# EAGLE design Flotelli (EAGLE 6.5.0)

## Sheet 1 of 5: CPU
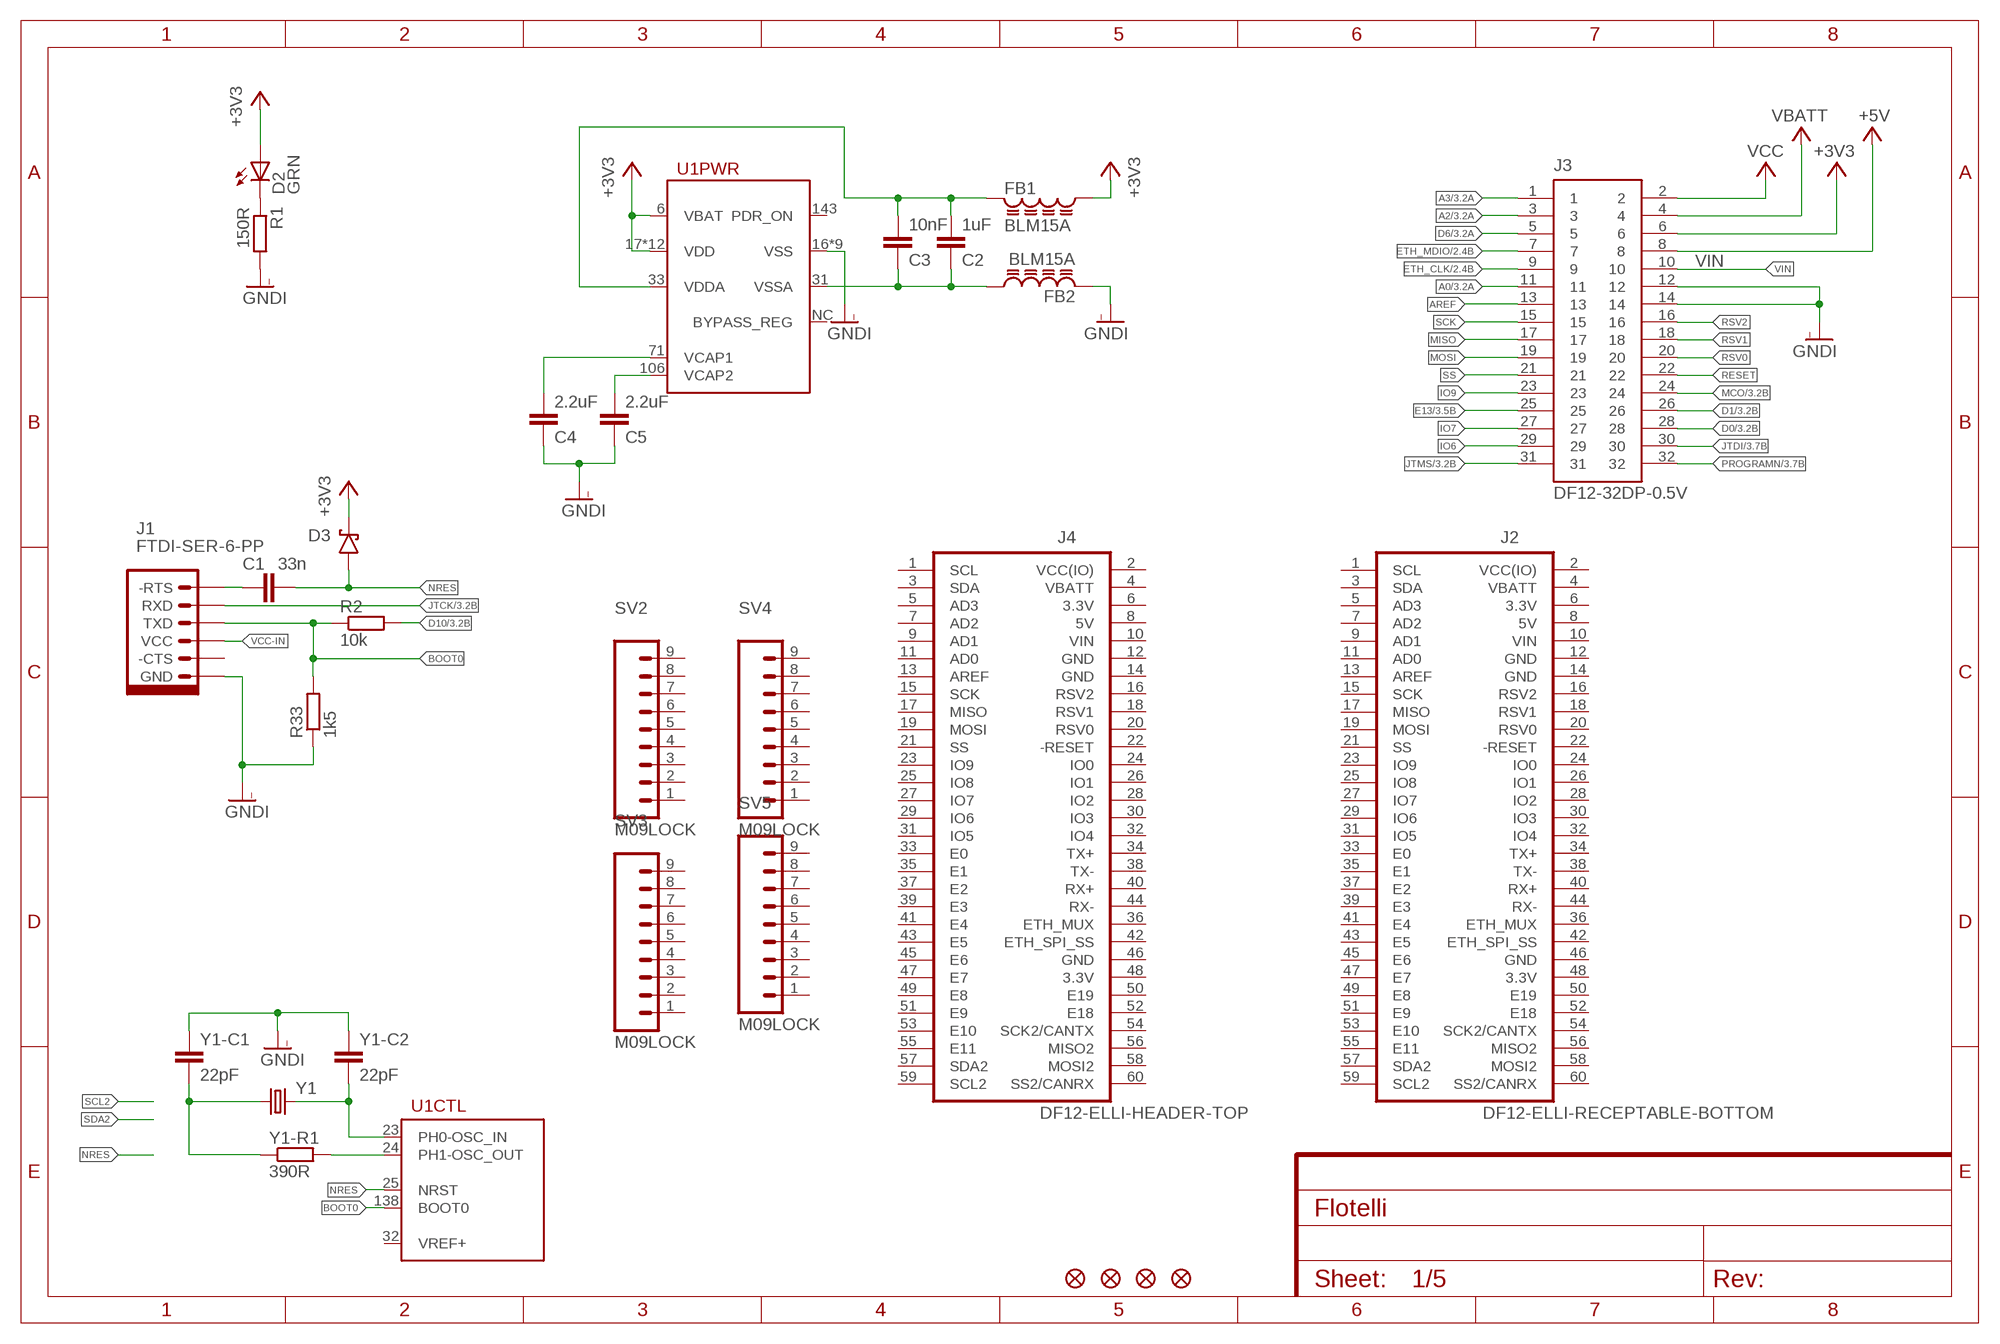
[diagram p0: schematic, sheet 1]

### Parts
C1  33n  C0402  [C0402]
C2  1uF  C0402  [C0402]
C3  10nF  C0402  [C0402]
C4  2.2uF  C0402  [C0402]
C5  2.2uF  C0402  [C0402]
D2  GRN  LED-GREEN0603  [LED-0603]
D3  BAT60J  [SOD323_DIODE]
FB1  BLM15A  LQM15  [0402]
FB2  BLM15A  LQM15  [0402]
FID1  FIDUCIAL""  [FIDUCIAL_1MM]
FID2  FIDUCIAL""  [FIDUCIAL_1MM]
FID3  FIDUCIAL""  [FIDUCIAL_1MM]
FID4  FIDUCIAL""  [FIDUCIAL_1MM]
J1  FTDI-SER-6-PP  [FTDI-SER-6-SIL]
J2  DF12-ELLI-RECEPTABLE-BOTTOM  [DF12-60DS-0.5V]
J3  DF12-32DP-0.5V  [DF12(4.0)-32DP-0.5V]
J4  DF12-ELLI-HEADER-TOP  [DF12(4.0)-60DP-0.5V]
R1  150R  R0402  [R0402]
R2  10k  R0402  [R0402]
R33  1k5  R0402  [R0402]
SV2  M09LOCK  [1X09_LOCK]
SV3  M09LOCK  [1X09_LOCK]
SV4  M09LOCK  [1X09_LOCK]
SV5  M09LOCK  [1X09_LOCK]
U1  STM32F429ZIT  [LQFP144]
Y1  CRYSTALSM49  [SM49]
Y1-C1  22pF  C0402  [C0402]
Y1-C2  22pF  C0402  [C0402]
Y1-R1  390R  R0402  [R0402]

### Nets
+3V3 [power]: D2.A D3.1(C) FB1.2 J3.6 U1.6(PWR:VBAT) U1.17(PWR:VDD) U1.30(PWR:VDD) U1.39(PWR:VDD) U1.52(PWR:VDD) U1.62(PWR:VDD) U1.72(PWR:VDD) U1.84(PWR:VDD) U1.95(PWR:VDD) U1.108(PWR:VDD) U1.121(PWR:VDD) U1.131(PWR:VDD) U1.144(PWR:VDD) ; also sheet 2
+5V [power]: J3.8
A0: J3.11 ; also sheet 3
A2: J3.3 ; also sheet 3
A3: J3.1 ; also sheet 3
AREF: J3.13
BOOT0: J1.TXD R2.1 R33.2 U1.138(CTL:BOOT0)
D0: J3.28 ; also sheet 3
D1: J3.26 ; also sheet 3
D6: J3.5 ; also sheet 3
D10: R2.2 ; also sheet 3
E13: J3.25 ; also sheet 3
ETH_CLK: J3.9 ; also sheet 2,3
ETH_MDIO: J3.7 ; also sheet 2,3
GNDI [power]: C4.1 C5.1 FB2.1 J1.GND J3.12 J3.14 R1.2 R33.1 U1.16(PWR:VSS) U1.38(PWR:VSS) U1.51(PWR:VSS) U1.61(PWR:VSS) U1.83(PWR:VSS) U1.94(PWR:VSS) U1.107(PWR:VSS) U1.120(PWR:VSS) U1.130(PWR:VSS) Y1-C1.1 Y1-C2.1 ; also sheet 2
IO6: J3.29
IO7: J3.27
IO9: J3.23
JTCK: J1.RXD ; also sheet 3
JTDI: J3.30 ; also sheet 3
JTMS: J3.31 ; also sheet 3
MCO: J3.24 ; also sheet 3
MISO: J3.17
MOSI: J3.19
N41567: D2.C R1.1
N98218 [power]: C2.1 C3.1 FB2.2 U1.31(PWR:VSSA)
N100630 [power]: C2.2 C3.2 FB1.1 U1.33(PWR:VDDA)
N205481: Y1-C1.2 Y1-R1.1 Y1.1
N$4: C4.2 U1.71(PWR:VCAP1)
N$5: C5.2 U1.106(PWR:VCAP2)
NDSR2: C1.1 J1.-RTS
NRES: C1.2 D3.2(A) U1.25(CTL:NRST)
PF0: U1.23(CTL:PH0-OSC_IN) Y1-C2.2 Y1.2
PF1: U1.24(CTL:PH1-OSC_OUT) Y1-R1.2
PROGRAMN: J3.32 ; also sheet 3
RESET: J3.22
RSV0: J3.20
RSV1: J3.18
RSV2: J3.16
SCK: J3.15
SS: J3.21
VBATT: J3.4
VCC: J3.2
VCC-IN: J1.VCC
VIN: J3.10
Unconnected: J1.-CTS J2.1(SCL) J2.3(SDA) J2.5(AD3) J2.7(AD2) J2.9(AD1) J2.11(AD0) J2.13(AREF) J2.15(SCK) J2.16(RSV2) J2.17(MISO) J2.18(RSV1) J2.19(MOSI) J2.20(RSV0) J2.21(SS) J2.22(-RESET) J2.23(IO9) J2.24(IO0) J2.25(IO8) J2.26(IO1) J2.27(IO7) J2.28(IO2) J2.29(IO6) J2.30(IO3) J2.31(IO5) J2.32(IO4) J2.33(E0) J2.34(TX+) J2.35(E1) J2.36(ETH_MUX) J2.37(E2) J2.38(TX-) J2.39(E3) J2.40(RX+) J2.41(E4) J2.42(ETH_SPI_SS) J2.43(E5) J2.44(RX-) J2.45(E6) J2.46(GND) J2.47(E7) J2.48(3.3V) J2.49(E8) J2.50(E19) J2.51(E9) J2.52(E18) J2.53(E10) J2.54(SCK2/CANTX) J2.55(E11) J2.56(MISO2) J2.57(SDA2) J2.58(MOSI2) J2.59(SCL2) J2.60(SS2/CANRX) J4.1(SCL) J4.3(SDA) J4.5(AD3) J4.7(AD2) J4.9(AD1) J4.11(AD0) J4.13(AREF) J4.15(SCK) J4.16(RSV2) J4.17(MISO) J4.18(RSV1) J4.19(MOSI) J4.20(RSV0) J4.21(SS) J4.22(-RESET) J4.23(IO9) J4.24(IO0) J4.25(IO8) J4.26(IO1) J4.27(IO7) J4.28(IO2) J4.29(IO6) J4.30(IO3) J4.31(IO5) J4.32(IO4) J4.33(E0) J4.34(TX+) J4.35(E1) J4.36(ETH_MUX) J4.37(E2) J4.38(TX-) J4.39(E3) J4.40(RX+) J4.41(E4) J4.42(ETH_SPI_SS) J4.43(E5) J4.44(RX-) J4.45(E6) J4.46(GND) J4.47(E7) J4.48(3.3V) J4.49(E8) J4.50(E19) J4.51(E9) J4.52(E18) J4.53(E10) J4.54(SCK2/CANTX) J4.55(E11) J4.56(MISO2) J4.57(SDA2) J4.58(MOSI2) J4.59(SCL2) J4.60(SS2/CANRX) SV2.1 SV2.2 SV2.3 SV2.4 SV2.5 SV2.6 SV2.7 SV2.8 SV2.9 SV3.1 SV3.2 SV3.3 SV3.4 SV3.5 SV3.6 SV3.7 SV3.8 SV3.9 SV4.1 SV4.2 SV4.3 SV4.4 SV4.5 SV4.6 SV4.7 SV4.8 SV4.9 SV5.1 SV5.2 SV5.3 SV5.4 SV5.5 SV5.6 SV5.7 SV5.8 SV5.9 U1.32(CTL:VREF+) U1.143(PWR:PDR_ON) U1.NC(PWR:BYPASS_REG)

## Sheet 2 of 5: Eth & USB
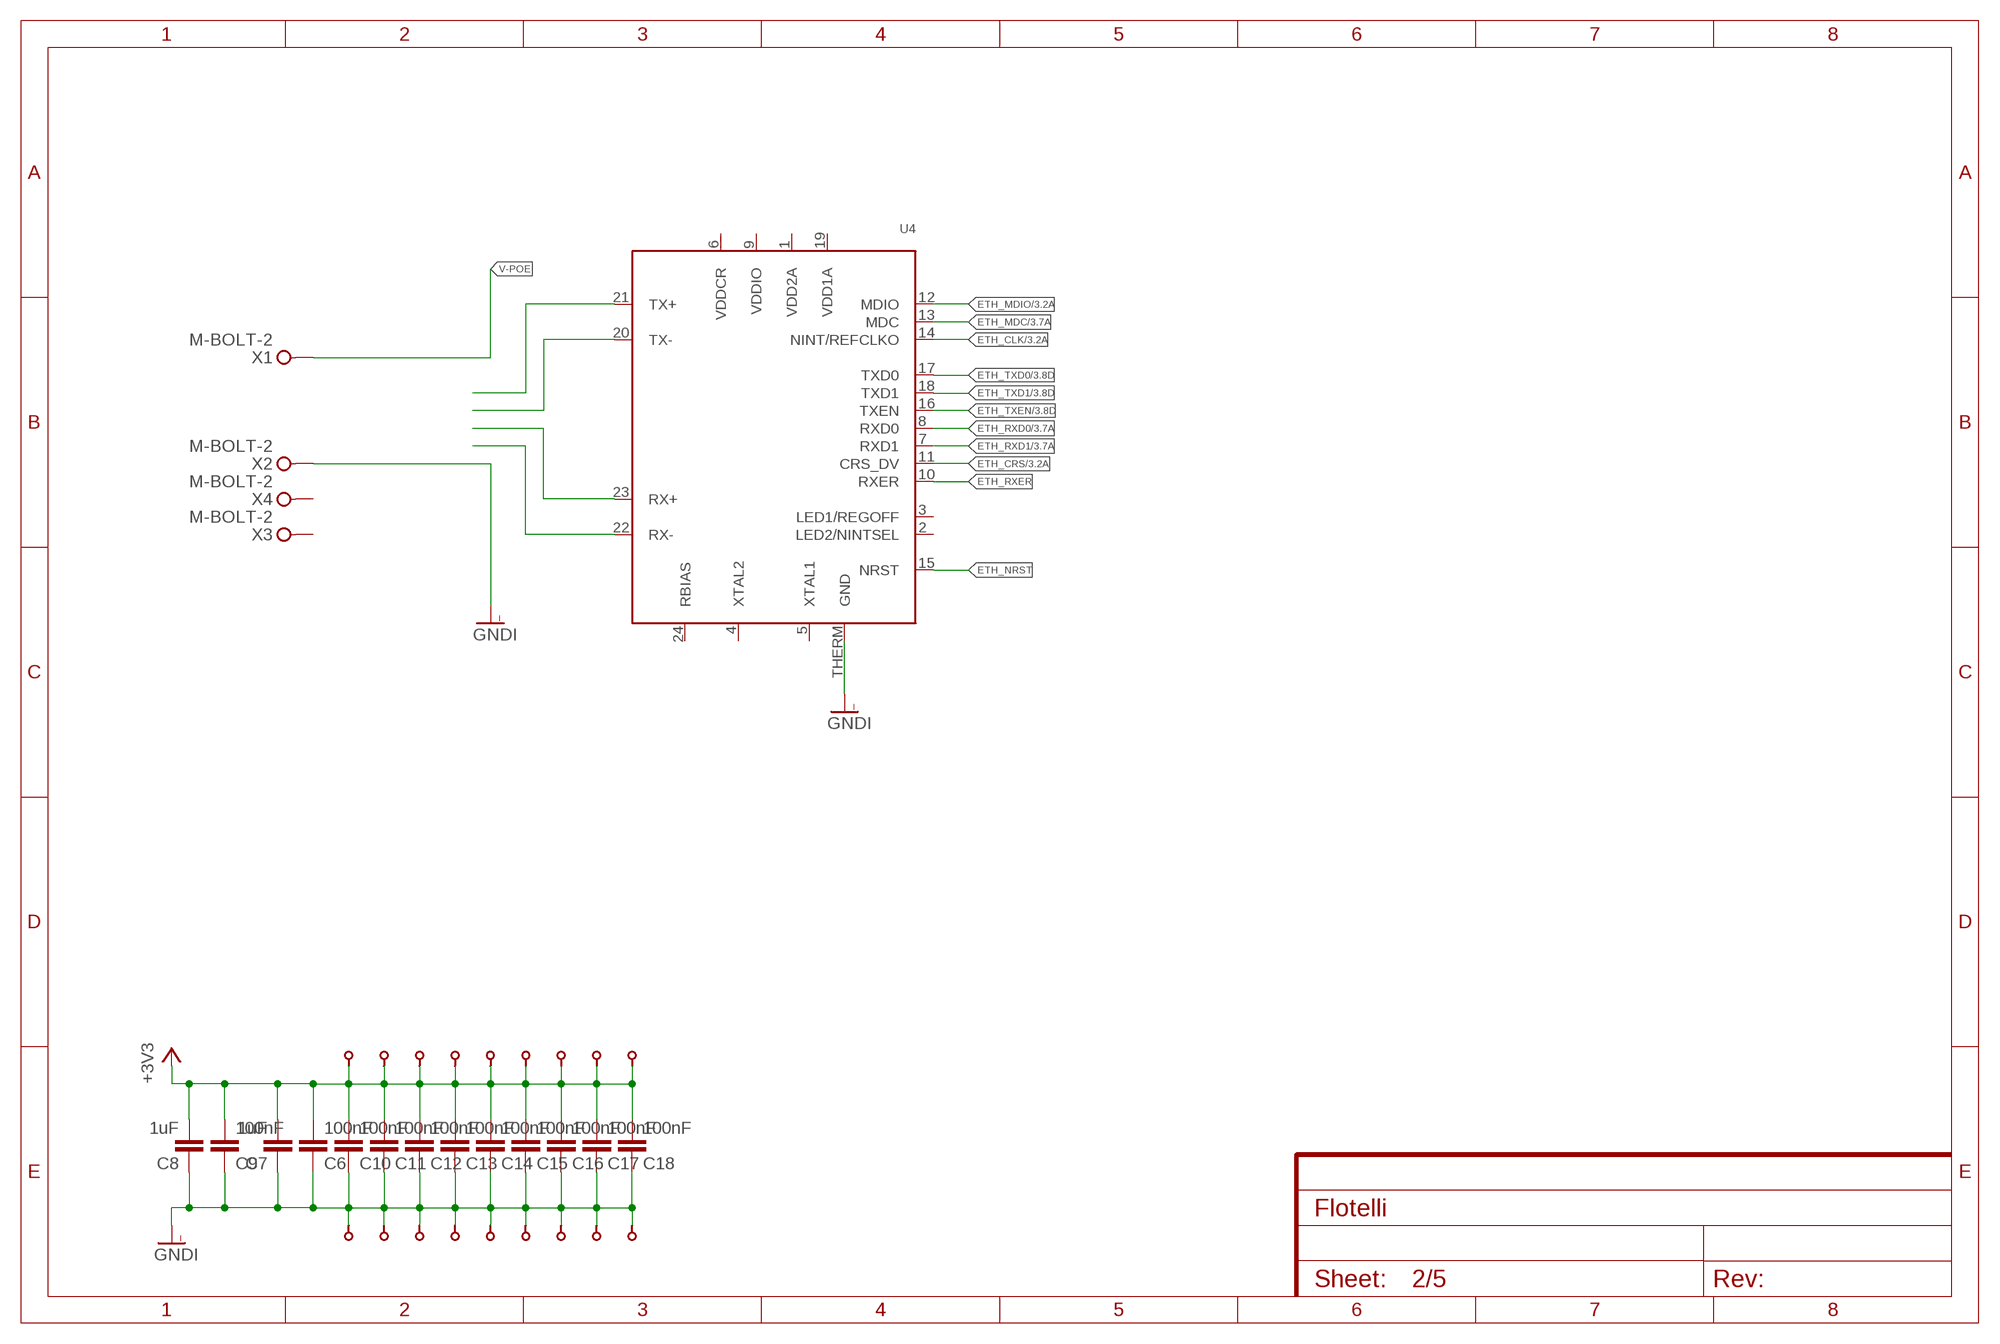
[diagram p1: schematic, sheet 2]

### Parts
C6  100nF  C0402  [C0402]
C7  1uF  C0402  [C0402]
C8  1uF  C0402  [C0402]
C9  100nF  C0402  [C0402]
C10  100nF  C0402  [C0402]
C11  100nF  C0402  [C0402]
C12  100nF  C0402  [C0402]
C13  100nF  C0402  [C0402]
C14  100nF  C0402  [C0402]
C15  100nF  C0402  [C0402]
C16  100nF  C0402  [C0402]
C17  100nF  C0402  [C0402]
C18  100nF  C0402  [C0402]
U4  LAN8720-H  [QFN-24_4MM-H]
VIA1  VIA-0.3  [VIA-0.3MM]
VIA2  VIA-0.3  [VIA-0.3MM]
VIA3  VIA-0.3  [VIA-0.3MM]
VIA4  VIA-0.3  [VIA-0.3MM]
VIA5  VIA-0.3  [VIA-0.3MM]
VIA6  VIA-0.3  [VIA-0.3MM]
VIA7  VIA-0.3  [VIA-0.3MM]
VIA8  VIA-0.3  [VIA-0.3MM]
VIA9  VIA-0.3  [VIA-0.3MM]
VIA10  VIA-0.3  [VIA-0.3MM]
VIA11  VIA-0.3  [VIA-0.3MM]
VIA12  VIA-0.3  [VIA-0.3MM]
VIA13  VIA-0.3  [VIA-0.3MM]
VIA14  VIA-0.3  [VIA-0.3MM]
VIA15  VIA-0.3  [VIA-0.3MM]
VIA16  VIA-0.3  [VIA-0.3MM]
VIA17  VIA-0.3  [VIA-0.3MM]
VIA18  VIA-0.3  [VIA-0.3MM]
X1  M-BOLT-2  [M2-1]
X2  M-BOLT-2  [M2-1]
X3  M-BOLT-2  [M2-1]
X4  M-BOLT-2  [M2-1]

### Nets
+3V3 [power]: C6.2 C7.2 C8.2 C9.2 C10.2 C11.2 C12.2 C13.2 C14.2 C15.2 C16.2 C17.2 C18.2 VIA1.1 VIA2.1 VIA3.1 VIA4.1 VIA5.1 VIA11.1 VIA13.1 VIA15.1 VIA17.1 ; also sheet 1
ETH_CLK: U4.14(NINT/REFCLKO) ; also sheet 1,3
ETH_CRS: U4.11(CRS_DV) ; also sheet 3
ETH_MDC: U4.13(MDC) ; also sheet 3
ETH_MDIO: U4.12(MDIO) ; also sheet 1,3
ETH_NRST: U4.15(NRST)
ETH_RXD0: U4.8(RXD0) ; also sheet 3
ETH_RXD1: U4.7(RXD1) ; also sheet 3
ETH_RXER: U4.10(RXER)
ETH_TXD0: U4.17(TXD0) ; also sheet 3
ETH_TXD1: U4.18(TXD1) ; also sheet 3
ETH_TXEN: U4.16(TXEN) ; also sheet 3
GNDI [power]: C6.1 C7.1 C8.1 C9.1 C10.1 C11.1 C12.1 C13.1 C14.1 C15.1 C16.1 C17.1 C18.1 U4.THERM(GND) VIA6.1 VIA7.1 VIA8.1 VIA9.1 VIA10.1 VIA12.1 VIA14.1 VIA16.1 VIA18.1 X2.1(KL1) ; also sheet 1
N$7: U4.22(RX-)
N$8: U4.23(RX+)
N$10: U4.21(TX+)
N$11: U4.20(TX-)
V-POE [power]: X1.1(KL1)
Unconnected: U4.1(VDD2A) U4.2(LED2/NINTSEL) U4.3(LED1/REGOFF) U4.4(XTAL2) U4.5(XTAL1) U4.6(VDDCR) U4.9(VDDIO) U4.19(VDD1A) U4.24(RBIAS) X3.1(KL1) X4.1(KL1)

## Sheet 3 of 5: STM32-ports
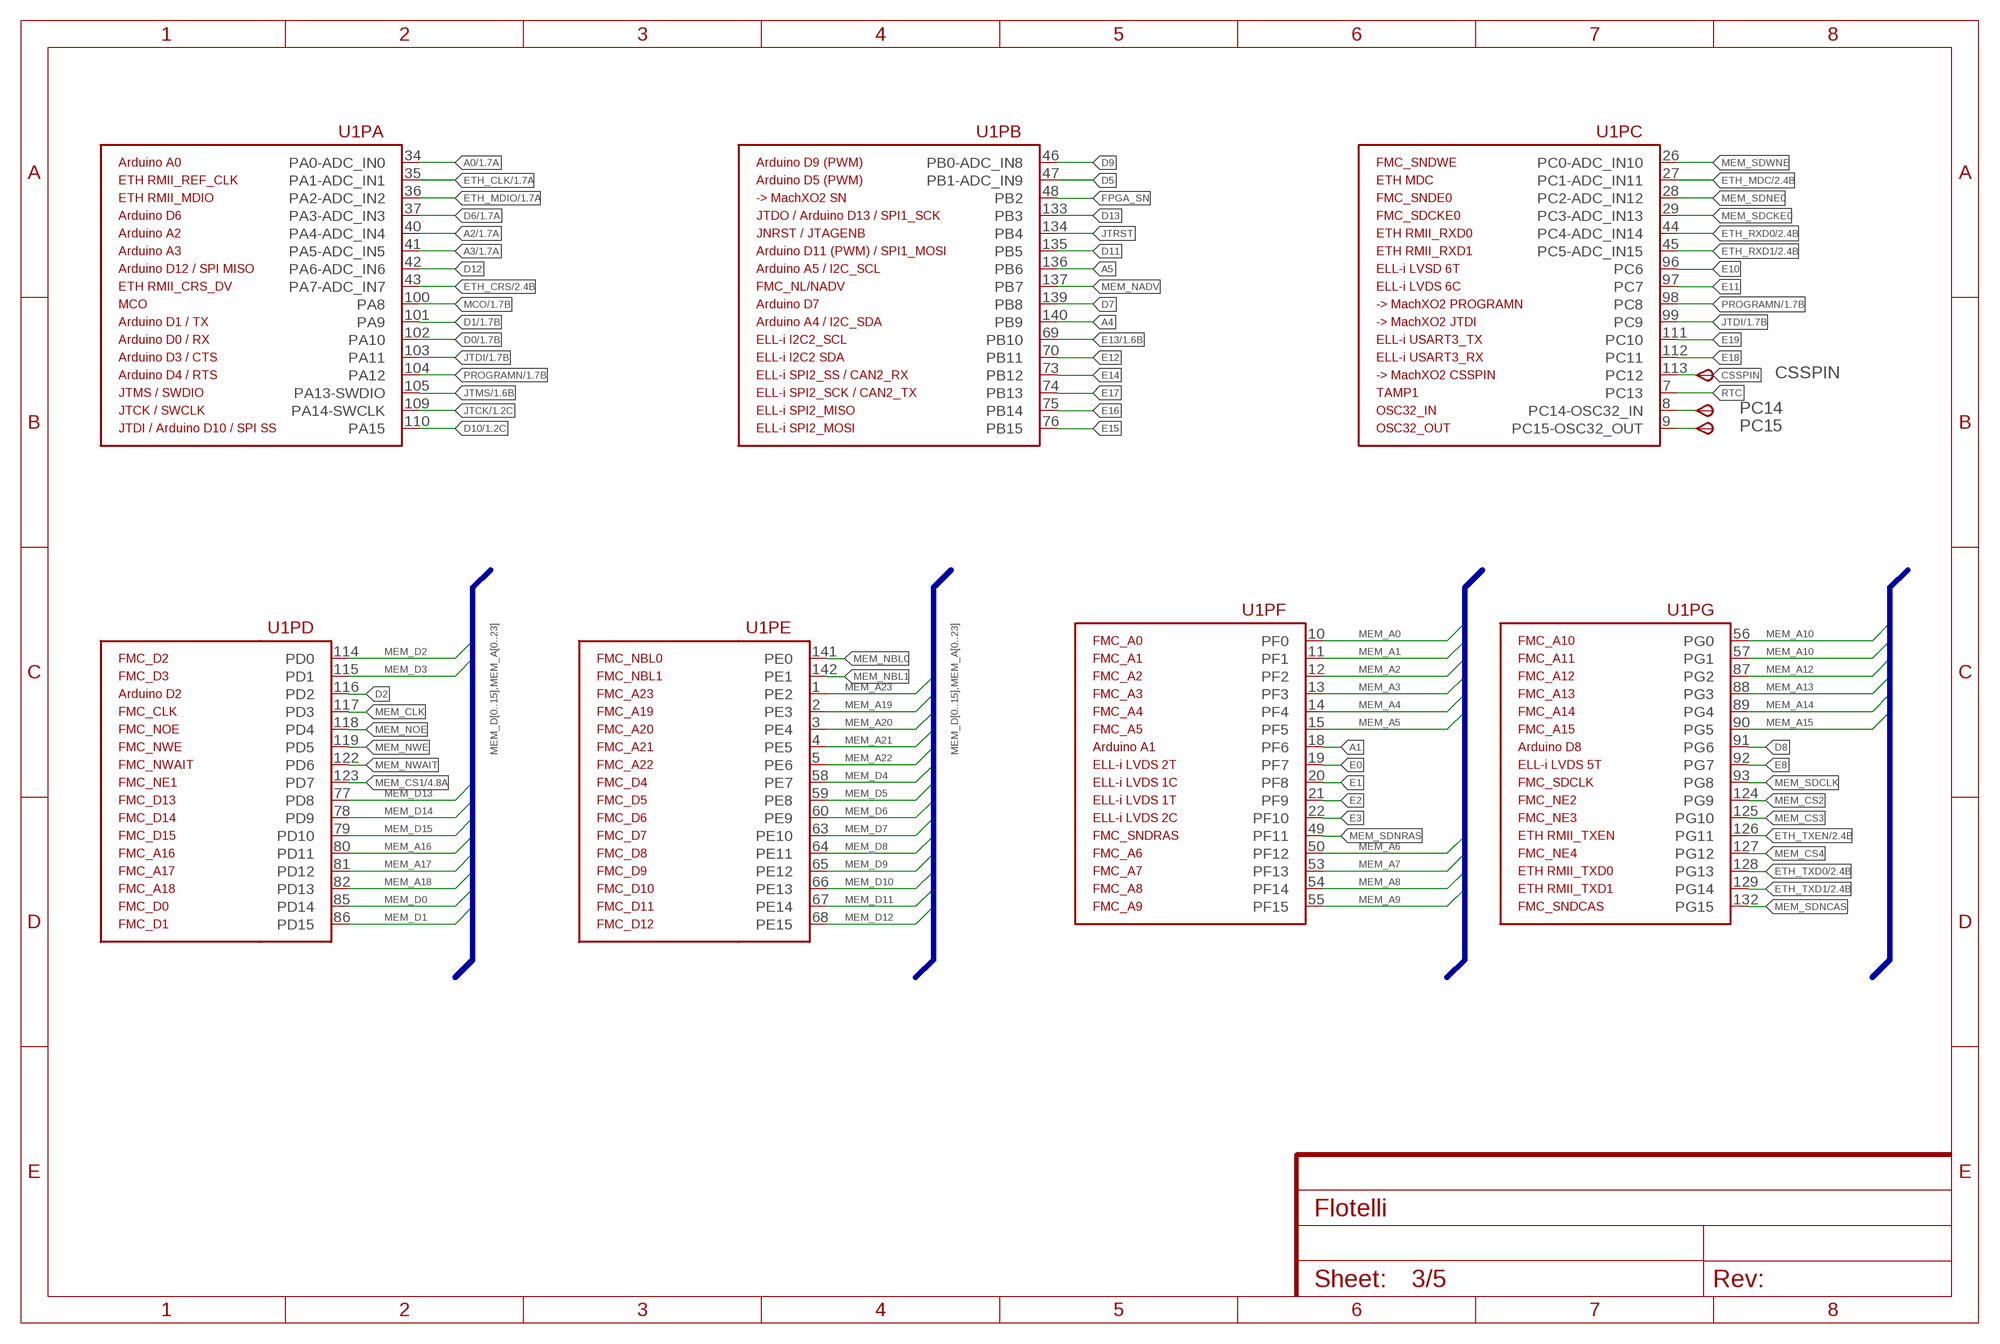
[diagram p2: schematic, sheet 3]

### Parts
CSSPIN  TPSB1,27  [B1,27]
PC14  TPSB1,27  [B1,27]
PC15  TPSB1,27  [B1,27]

### Nets
A0: U1.34(PA:PA0-ADC_IN0) ; also sheet 1
A1: U1.18(PF:PF6)
A2: U1.40(PA:PA4-ADC_IN4) ; also sheet 1
A3: U1.41(PA:PA5-ADC_IN5) ; also sheet 1
A4: U1.140(PB:PB9)
A5: U1.136(PB:PB6)
CSSPIN: CSSPIN.TP(PP) U1.113(PC:PC12)
D0: U1.102(PA:PA10) ; also sheet 1
D1: U1.101(PA:PA9) ; also sheet 1
D2: U1.116(PD:PD2)
D5: U1.47(PB:PB1-ADC_IN9)
D6: U1.37(PA:PA3-ADC_IN3) ; also sheet 1
D7: U1.139(PB:PB8)
D8: U1.91(PG:PG6)
D9: U1.46(PB:PB0-ADC_IN8)
D10: U1.110(PA:PA15) ; also sheet 1
D11: U1.135(PB:PB5)
D12: U1.42(PA:PA6-ADC_IN6)
D13: U1.133(PB:PB3)
E0: U1.19(PF:PF7)
E1: U1.20(PF:PF8)
E2: U1.21(PF:PF9)
E3: U1.22(PF:PF10)
E8: U1.92(PG:PG7)
E10: U1.96(PC:PC6)
E11: U1.97(PC:PC7)
E12: U1.70(PB:PB11)
E13: U1.69(PB:PB10) ; also sheet 1
E14: U1.73(PB:PB12)
E15: U1.76(PB:PB15)
E16: U1.75(PB:PB14)
E17: U1.74(PB:PB13)
E18: U1.112(PC:PC11)
E19: U1.111(PC:PC10)
ETH_CLK: U1.35(PA:PA1-ADC_IN1) ; also sheet 1,2
ETH_CRS: U1.43(PA:PA7-ADC_IN7) ; also sheet 2
ETH_MDC: U1.27(PC:PC1-ADC_IN11) ; also sheet 2
ETH_MDIO: U1.36(PA:PA2-ADC_IN2) ; also sheet 1,2
ETH_RXD0: U1.44(PC:PC4-ADC_IN14) ; also sheet 2
ETH_RXD1: U1.45(PC:PC5-ADC_IN15) ; also sheet 2
ETH_TXD0: U1.128(PG:PG13) ; also sheet 2
ETH_TXD1: U1.129(PG:PG14) ; also sheet 2
ETH_TXEN: U1.126(PG:PG11) ; also sheet 2
FPGA_SN: U1.48(PB:PB2)
JTCK: U1.109(PA:PA14-SWCLK) ; also sheet 1
JTDI: U1.99(PC:PC9) U1.103(PA:PA11) ; also sheet 1
JTMS: U1.105(PA:PA13-SWDIO) ; also sheet 1
JTRST: U1.134(PB:PB4)
MCO: U1.100(PA:PA8) ; also sheet 1
MEM_A0: U1.10(PF:PF0)
MEM_A1: U1.11(PF:PF1)
MEM_A2: U1.12(PF:PF2)
MEM_A3: U1.13(PF:PF3)
MEM_A4: U1.14(PF:PF4)
MEM_A5: U1.15(PF:PF5)
MEM_A6: U1.50(PF:PF12)
MEM_A7: U1.53(PF:PF13)
MEM_A8: U1.54(PF:PF14)
MEM_A9: U1.55(PF:PF15)
MEM_A10: U1.56(PG:PG0) U1.57(PG:PG1)
MEM_A12: U1.87(PG:PG2)
MEM_A13: U1.88(PG:PG3)
MEM_A14: U1.89(PG:PG4)
MEM_A15: U1.90(PG:PG5)
MEM_A16: U1.80(PD:PD11) ; also sheet 4
MEM_A17: U1.81(PD:PD12) ; also sheet 4
MEM_A18: U1.82(PD:PD13) ; also sheet 4
MEM_A19: U1.2(PE:PE3) ; also sheet 4
MEM_A20: U1.3(PE:PE4)
MEM_A21: U1.4(PE:PE5) ; also sheet 4
MEM_A22: U1.5(PE:PE6) ; also sheet 4
MEM_A23: U1.1(PE:PE2) ; also sheet 4
MEM_CLK: U1.117(PD:PD3)
MEM_CS1: U1.123(PD:PD7) ; also sheet 4
MEM_CS2: U1.124(PG:PG9)
MEM_CS3: U1.125(PG:PG10)
MEM_CS4: U1.127(PG:PG12)
MEM_D0: U1.85(PD:PD14) ; also sheet 4
MEM_D1: U1.86(PD:PD15) ; also sheet 4
MEM_D2: U1.114(PD:PD0) ; also sheet 4
MEM_D3: U1.115(PD:PD1) ; also sheet 4
MEM_D4: U1.58(PE:PE7) ; also sheet 4
MEM_D5: U1.59(PE:PE8) ; also sheet 4
MEM_D6: U1.60(PE:PE9) ; also sheet 4
MEM_D7: U1.63(PE:PE10) ; also sheet 4
MEM_D8: U1.64(PE:PE11) ; also sheet 4
MEM_D9: U1.65(PE:PE12) ; also sheet 4
MEM_D10: U1.66(PE:PE13) ; also sheet 4
MEM_D11: U1.67(PE:PE14) ; also sheet 4
MEM_D12: U1.68(PE:PE15) ; also sheet 4
MEM_D13: U1.77(PD:PD8) ; also sheet 4
MEM_D14: U1.78(PD:PD9) ; also sheet 4
MEM_D15: U1.79(PD:PD10) ; also sheet 4
MEM_NADV: U1.137(PB:PB7)
MEM_NBL0: U1.141(PE:PE0)
MEM_NBL1: U1.142(PE:PE1)
MEM_NOE: U1.118(PD:PD4)
MEM_NWAIT: U1.122(PD:PD6)
MEM_NWE: U1.119(PD:PD5)
MEM_SDCKE0: U1.29(PC:PC3-ADC_IN13)
MEM_SDCLK: U1.93(PG:PG8)
MEM_SDNCAS: U1.132(PG:PG15)
MEM_SDNE0: U1.28(PC:PC2-ADC_IN12)
MEM_SDNRAS: U1.49(PF:PF11)
MEM_SDWNE: U1.26(PC:PC0-ADC_IN10)
N$2: PC14.TP(PP) U1.8(PC:PC14-OSC32_IN)
N$3: PC15.TP(PP) U1.9(PC:PC15-OSC32_OUT)
PROGRAMN: U1.98(PC:PC8) U1.104(PA:PA12) ; also sheet 1
RTC: U1.7(PC:PC13)

### Buses
MEM_D[0..15],MEM_A[0..23]

## Sheet 4 of 5: FPGA-ports
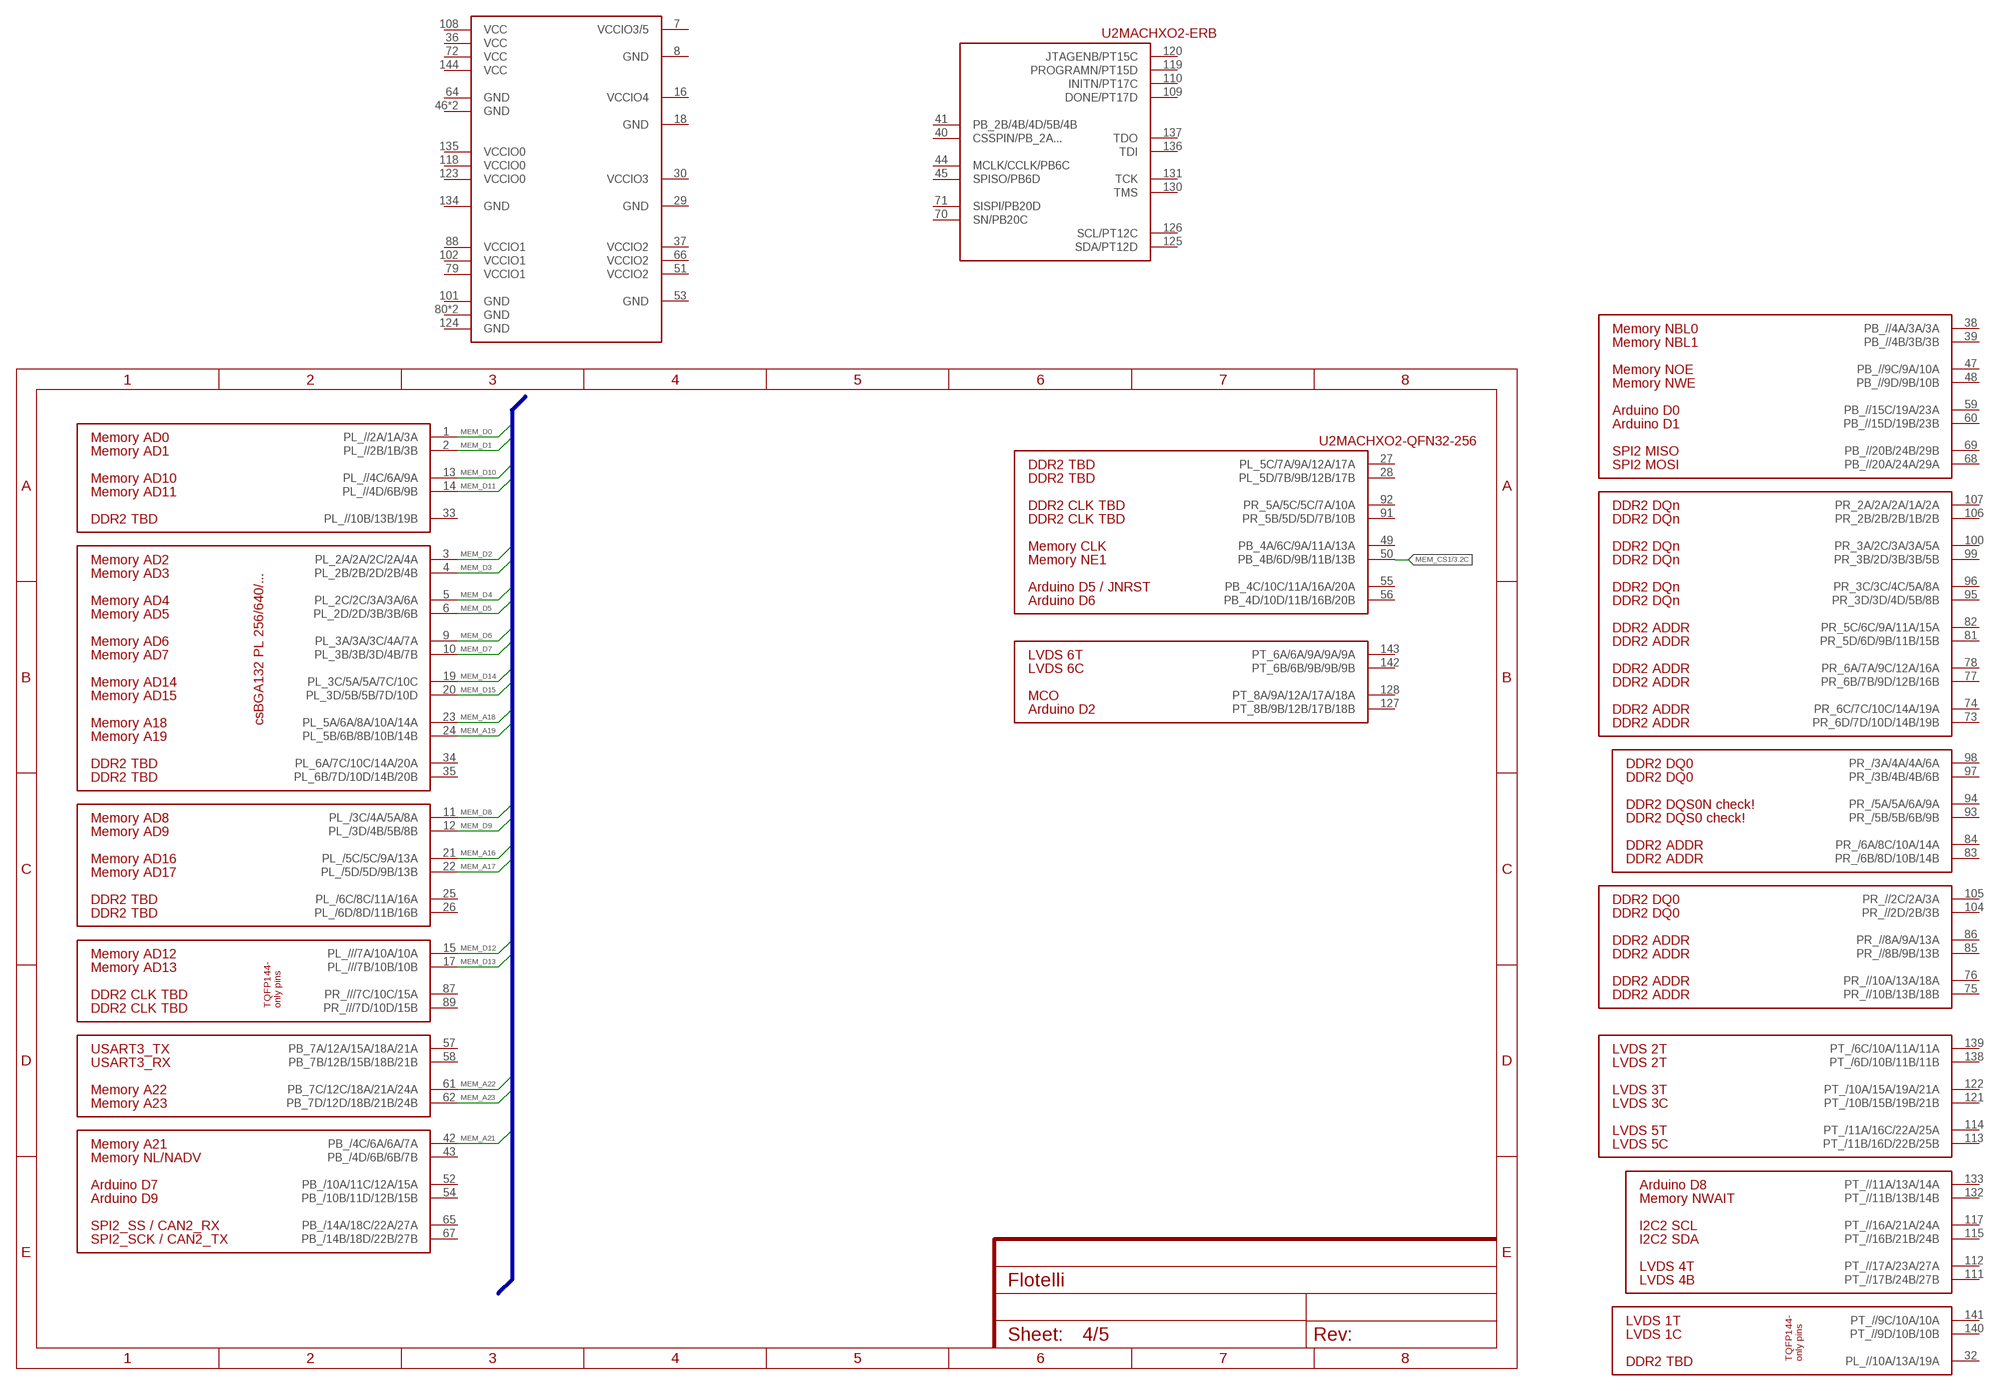
[diagram p3: schematic, sheet 4]

### Parts
U2  LCMXO2-2000HC-4TG144  [TQFP144]

### Nets
MEM_A16: U2.21(MACHXO2-CSBGA132-640-LEFT:PL_/5C/5C/9A/13A) ; also sheet 3
MEM_A17: U2.22(MACHXO2-CSBGA132-640-LEFT:PL_/5D/5D/9B/13B) ; also sheet 3
MEM_A18: U2.23(MACHXO2-CSBGA132-256-LEFT:PL_5A/6A/8A/10A/14A) ; also sheet 3
MEM_A19: U2.24(MACHXO2-CSBGA132-256-LEFT:PL_5B/6B/8B/10B/14B) ; also sheet 3
MEM_A21: U2.42(MACHXO2-CSBGA132-640-BOTTOM:PB_/4C/6A/6A/7A) ; also sheet 3
MEM_A22: U2.61(MACHXO2-CSBGA132-256-BOTTOM:PB_7C/12C/18A/21A/24A) ; also sheet 3
MEM_A23: U2.62(MACHXO2-CSBGA132-256-BOTTOM:PB_7D/12D/18B/21B/24B) ; also sheet 3
MEM_CS1: U2.50(MACHXO2-QFN32-256:PB_4B/6D/9B/11B/13B) ; also sheet 3
MEM_D0: U2.1(MACHXO2-CSBGA132-1200-LEFT:PL_//2A/1A/3A) ; also sheet 3
MEM_D1: U2.2(MACHXO2-CSBGA132-1200-LEFT:PL_//2B/1B/3B) ; also sheet 3
MEM_D2: U2.3(MACHXO2-CSBGA132-256-LEFT:PL_2A/2A/2C/2A/4A) ; also sheet 3
MEM_D3: U2.4(MACHXO2-CSBGA132-256-LEFT:PL_2B/2B/2D/2B/4B) ; also sheet 3
MEM_D4: U2.5(MACHXO2-CSBGA132-256-LEFT:PL_2C/2C/3A/3A/6A) ; also sheet 3
MEM_D5: U2.6(MACHXO2-CSBGA132-256-LEFT:PL_2D/2D/3B/3B/6B) ; also sheet 3
MEM_D6: U2.9(MACHXO2-CSBGA132-256-LEFT:PL_3A/3A/3C/4A/7A) ; also sheet 3
MEM_D7: U2.10(MACHXO2-CSBGA132-256-LEFT:PL_3B/3B/3D/4B/7B) ; also sheet 3
MEM_D8: U2.11(MACHXO2-CSBGA132-640-LEFT:PL_/3C/4A/5A/8A) ; also sheet 3
MEM_D9: U2.12(MACHXO2-CSBGA132-640-LEFT:PL_/3D/4B/5B/8B) ; also sheet 3
MEM_D10: U2.13(MACHXO2-CSBGA132-1200-LEFT:PL_//4C/6A/9A) ; also sheet 3
MEM_D11: U2.14(MACHXO2-CSBGA132-1200-LEFT:PL_//4D/6B/9B) ; also sheet 3
MEM_D12: U2.15(MACHXO2-TEFQ144-2000:PL_///7A/10A/10A) ; also sheet 3
MEM_D13: U2.17(MACHXO2-TEFQ144-2000:PL_///7B/10B/10B) ; also sheet 3
MEM_D14: U2.19(MACHXO2-CSBGA132-256-LEFT:PL_3C/5A/5A/7C/10C) ; also sheet 3
MEM_D15: U2.20(MACHXO2-CSBGA132-256-LEFT:PL_3D/5B/5B/7D/10D) ; also sheet 3
Unconnected: U2.7(MACHXO2-CSBGA132-PWR:VCCIO3/5) U2.8(MACHXO2-CSBGA132-PWR:GND) U2.16(MACHXO2-CSBGA132-PWR:VCCIO4) U2.18(MACHXO2-CSBGA132-PWR:GND) U2.25(MACHXO2-CSBGA132-640-LEFT:PL_/6C/8C/11A/16A) U2.26(MACHXO2-CSBGA132-640-LEFT:PL_/6D/8D/11B/16B) U2.27(MACHXO2-QFN32-256:PL_5C/7A/9A/12A/17A) U2.28(MACHXO2-QFN32-256:PL_5D/7B/9B/12B/17B) U2.29(MACHXO2-CSBGA132-PWR:GND) U2.30(MACHXO2-CSBGA132-PWR:VCCIO3) U2.32(MACHXO2-TQFP144:PL_//10A/13A/19A) U2.33(MACHXO2-CSBGA132-1200-LEFT:PL_//10B/13B/19B) U2.34(MACHXO2-CSBGA132-256-LEFT:PL_6A/7C/10C/14A/20A) U2.35(MACHXO2-CSBGA132-256-LEFT:PL_6B/7D/10D/14B/20B) U2.36(MACHXO2-CSBGA132-PWR:VCC) U2.37(MACHXO2-CSBGA132-PWR:VCCIO2) U2.38(MACHXO2-CSBGA132-1200-BOTTOM:PB_//4A/3A/3A) U2.39(MACHXO2-CSBGA132-1200-BOTTOM:PB_//4B/3B/3B) U2.40(MACHXO2-ERB:CSSPIN/PB_2A...) U2.41(MACHXO2-ERB:PB_2B/4B/4D/5B/4B) U2.43(MACHXO2-CSBGA132-640-BOTTOM:PB_/4D/6B/6B/7B) U2.44(MACHXO2-ERB:MCLK/CCLK/PB6C) U2.45(MACHXO2-ERB:SPISO/PB6D) U2.46(MACHXO2-CSBGA132-PWR:GND) U2.47(MACHXO2-CSBGA132-1200-BOTTOM:PB_//9C/9A/10A) U2.48(MACHXO2-CSBGA132-1200-BOTTOM:PB_//9D/9B/10B) U2.49(MACHXO2-QFN32-256:PB_4A/6C/9A/11A/13A) U2.51(MACHXO2-CSBGA132-PWR:VCCIO2) U2.52(MACHXO2-CSBGA132-640-BOTTOM:PB_/10A/11C/12A/15A) U2.53(MACHXO2-CSBGA132-PWR:GND) U2.54(MACHXO2-CSBGA132-640-BOTTOM:PB_/10B/11D/12B/15B) U2.55(MACHXO2-QFN32-256:PB_4C/10C/11A/16A/20A) U2.56(MACHXO2-QFN32-256:PB_4D/10D/11B/16B/20B) U2.57(MACHXO2-CSBGA132-256-BOTTOM:PB_7A/12A/15A/18A/21A) U2.58(MACHXO2-CSBGA132-256-BOTTOM:PB_7B/12B/15B/18B/21B) U2.59(MACHXO2-CSBGA132-1200-BOTTOM:PB_//15C/19A/23A) U2.60(MACHXO2-CSBGA132-1200-BOTTOM:PB_//15D/19B/23B) U2.64(MACHXO2-CSBGA132-PWR:GND) U2.65(MACHXO2-CSBGA132-640-BOTTOM:PB_/14A/18C/22A/27A) U2.66(MACHXO2-CSBGA132-PWR:VCCIO2) U2.67(MACHXO2-CSBGA132-640-BOTTOM:PB_/14B/18D/22B/27B) U2.68(MACHXO2-CSBGA132-1200-BOTTOM:PB_//20A/24A/29A) U2.69(MACHXO2-CSBGA132-1200-BOTTOM:PB_//20B/24B/29B) U2.70(MACHXO2-ERB:SN/PB20C) U2.71(MACHXO2-ERB:SISPI/PB20D) U2.72(MACHXO2-CSBGA132-PWR:VCC) U2.73(MACHXO2-CSBGA132-256-RIGHT:PR_6D/7D/10D/14B/19B) U2.74(MACHXO2-CSBGA132-256-RIGHT:PR_6C/7C/10C/14A/19A) U2.75(MACHXO2-CSBGA132-1200-RIGHT:PR_//10B/13B/18B) U2.76(MACHXO2-CSBGA132-1200-RIGHT:PR_//10A/13A/18A) U2.77(MACHXO2-CSBGA132-256-RIGHT:PR_6B/7B/9D/12B/16B) U2.78(MACHXO2-CSBGA132-256-RIGHT:PR_6A/7A/9C/12A/16A) U2.79(MACHXO2-CSBGA132-PWR:VCCIO1) U2.80(MACHXO2-CSBGA132-PWR:GND) U2.81(MACHXO2-CSBGA132-256-RIGHT:PR_5D/6D/9B/11B/15B) U2.82(MACHXO2-CSBGA132-256-RIGHT:PR_5C/6C/9A/11A/15A) U2.83(MACHXO2-CSBGA132-640-RIGHT:PR_/6B/8D/10B/14B) U2.84(MACHXO2-CSBGA132-640-RIGHT:PR_/6A/8C/10A/14A) U2.85(MACHXO2-CSBGA132-1200-RIGHT:PR_//8B/9B/13B) U2.86(MACHXO2-CSBGA132-1200-RIGHT:PR_//8A/9A/13A) U2.87(MACHXO2-TEFQ144-2000:PR_///7C/10C/15A) U2.88(MACHXO2-CSBGA132-PWR:VCCIO1) U2.89(MACHXO2-TEFQ144-2000:PR_///7D/10D/15B) U2.90(MACHXO2-CSBGA132-PWR:GND) U2.91(MACHXO2-QFN32-256:PR_5B/5D/5D/7B/10B) U2.92(MACHXO2-QFN32-256:PR_5A/5C/5C/7A/10A) U2.93(MACHXO2-CSBGA132-640-RIGHT:PR_/5B/5B/6B/9B) U2.94(MACHXO2-CSBGA132-640-RIGHT:PR_/5A/5A/6A/9A) U2.95(MACHXO2-CSBGA132-256-RIGHT:PR_3D/3D/4D/5B/8B) U2.96(MACHXO2-CSBGA132-256-RIGHT:PR_3C/3C/4C/5A/8A) U2.97(MACHXO2-CSBGA132-640-RIGHT:PR_/3B/4B/4B/6B) U2.98(MACHXO2-CSBGA132-640-RIGHT:PR_/3A/4A/4A/6A) U2.99(MACHXO2-CSBGA132-256-RIGHT:PR_3B/2D/3B/3B/5B) U2.100(MACHXO2-CSBGA132-256-RIGHT:PR_3A/2C/3A/3A/5A) U2.101(MACHXO2-CSBGA132-PWR:GND) U2.102(MACHXO2-CSBGA132-PWR:VCCIO1) U2.104(MACHXO2-CSBGA132-1200-RIGHT:PR_//2D/2B/3B) U2.105(MACHXO2-CSBGA132-1200-RIGHT:PR_//2C/2A/3A) U2.106(MACHXO2-CSBGA132-256-RIGHT:PR_2B/2B/2B/1B/2B) U2.107(MACHXO2-CSBGA132-256-RIGHT:PR_2A/2A/2A/1A/2A) U2.108(MACHXO2-CSBGA132-PWR:VCC) U2.109(MACHXO2-ERB:DONE/PT17D) U2.110(MACHXO2-ERB:INITN/PT17C) U2.111(MACHXO2-CSBGA132-1200-TOP:PT_//17B/24B/27B) U2.112(MACHXO2-CSBGA132-1200-TOP:PT_//17A/23A/27A) U2.113(MACHXO2-CSBGA132-640-TOP:PT_/11B/16D/22B/25B) U2.114(MACHXO2-CSBGA132-640-TOP:PT_/11A/16C/22A/25A) U2.115(MACHXO2-CSBGA132-1200-TOP:PT_//16B/21B/24B) U2.116(MACHXO2-CSBGA132-PWR:GND) U2.117(MACHXO2-CSBGA132-1200-TOP:PT_//16A/21A/24A) U2.118(MACHXO2-CSBGA132-PWR:VCCIO0) U2.119(MACHXO2-ERB:PROGRAMN/PT15D) U2.120(MACHXO2-ERB:JTAGENB/PT15C) U2.121(MACHXO2-CSBGA132-640-TOP:PT_/10B/15B/19B/21B) U2.122(MACHXO2-CSBGA132-640-TOP:PT_/10A/15A/19A/21A) U2.123(MACHXO2-CSBGA132-PWR:VCCIO0) U2.124(MACHXO2-CSBGA132-PWR:GND) U2.125(MACHXO2-ERB:SDA/PT12D) U2.126(MACHXO2-ERB:SCL/PT12C) U2.127(MACHXO2-CSBGA132-256-TOP:PT_8B/9B/12B/17B/18B) U2.128(MACHXO2-CSBGA132-256-TOP:PT_8A/9A/12A/17A/18A) U2.130(MACHXO2-ERB:TMS) U2.131(MACHXO2-ERB:TCK) U2.132(MACHXO2-CSBGA132-1200-TOP:PT_//11B/13B/14B) U2.133(MACHXO2-CSBGA132-1200-TOP:PT_//11A/13A/14A) U2.134(MACHXO2-CSBGA132-PWR:GND) U2.135(MACHXO2-CSBGA132-PWR:VCCIO0) U2.136(MACHXO2-ERB:TDI) U2.137(MACHXO2-ERB:TDO) U2.138(MACHXO2-CSBGA132-640-TOP:PT_/6D/10B/11B/11B) U2.139(MACHXO2-CSBGA132-640-TOP:PT_/6C/10A/11A/11A) U2.140(MACHXO2-TQFP144:PT_//9D/10B/10B) U2.141(MACHXO2-TQFP144:PT_//9C/10A/10A) U2.142(MACHXO2-CSBGA132-256-TOP:PT_6B/6B/9B/9B/9B) U2.143(MACHXO2-CSBGA132-256-TOP:PT_6A/6A/9A/9A/9A) U2.144(MACHXO2-CSBGA132-PWR:VCC)

### Buses
MEM_D[0..15],MEM_A[0..23]

## Sheet 5 of 5: DIP switches etc.
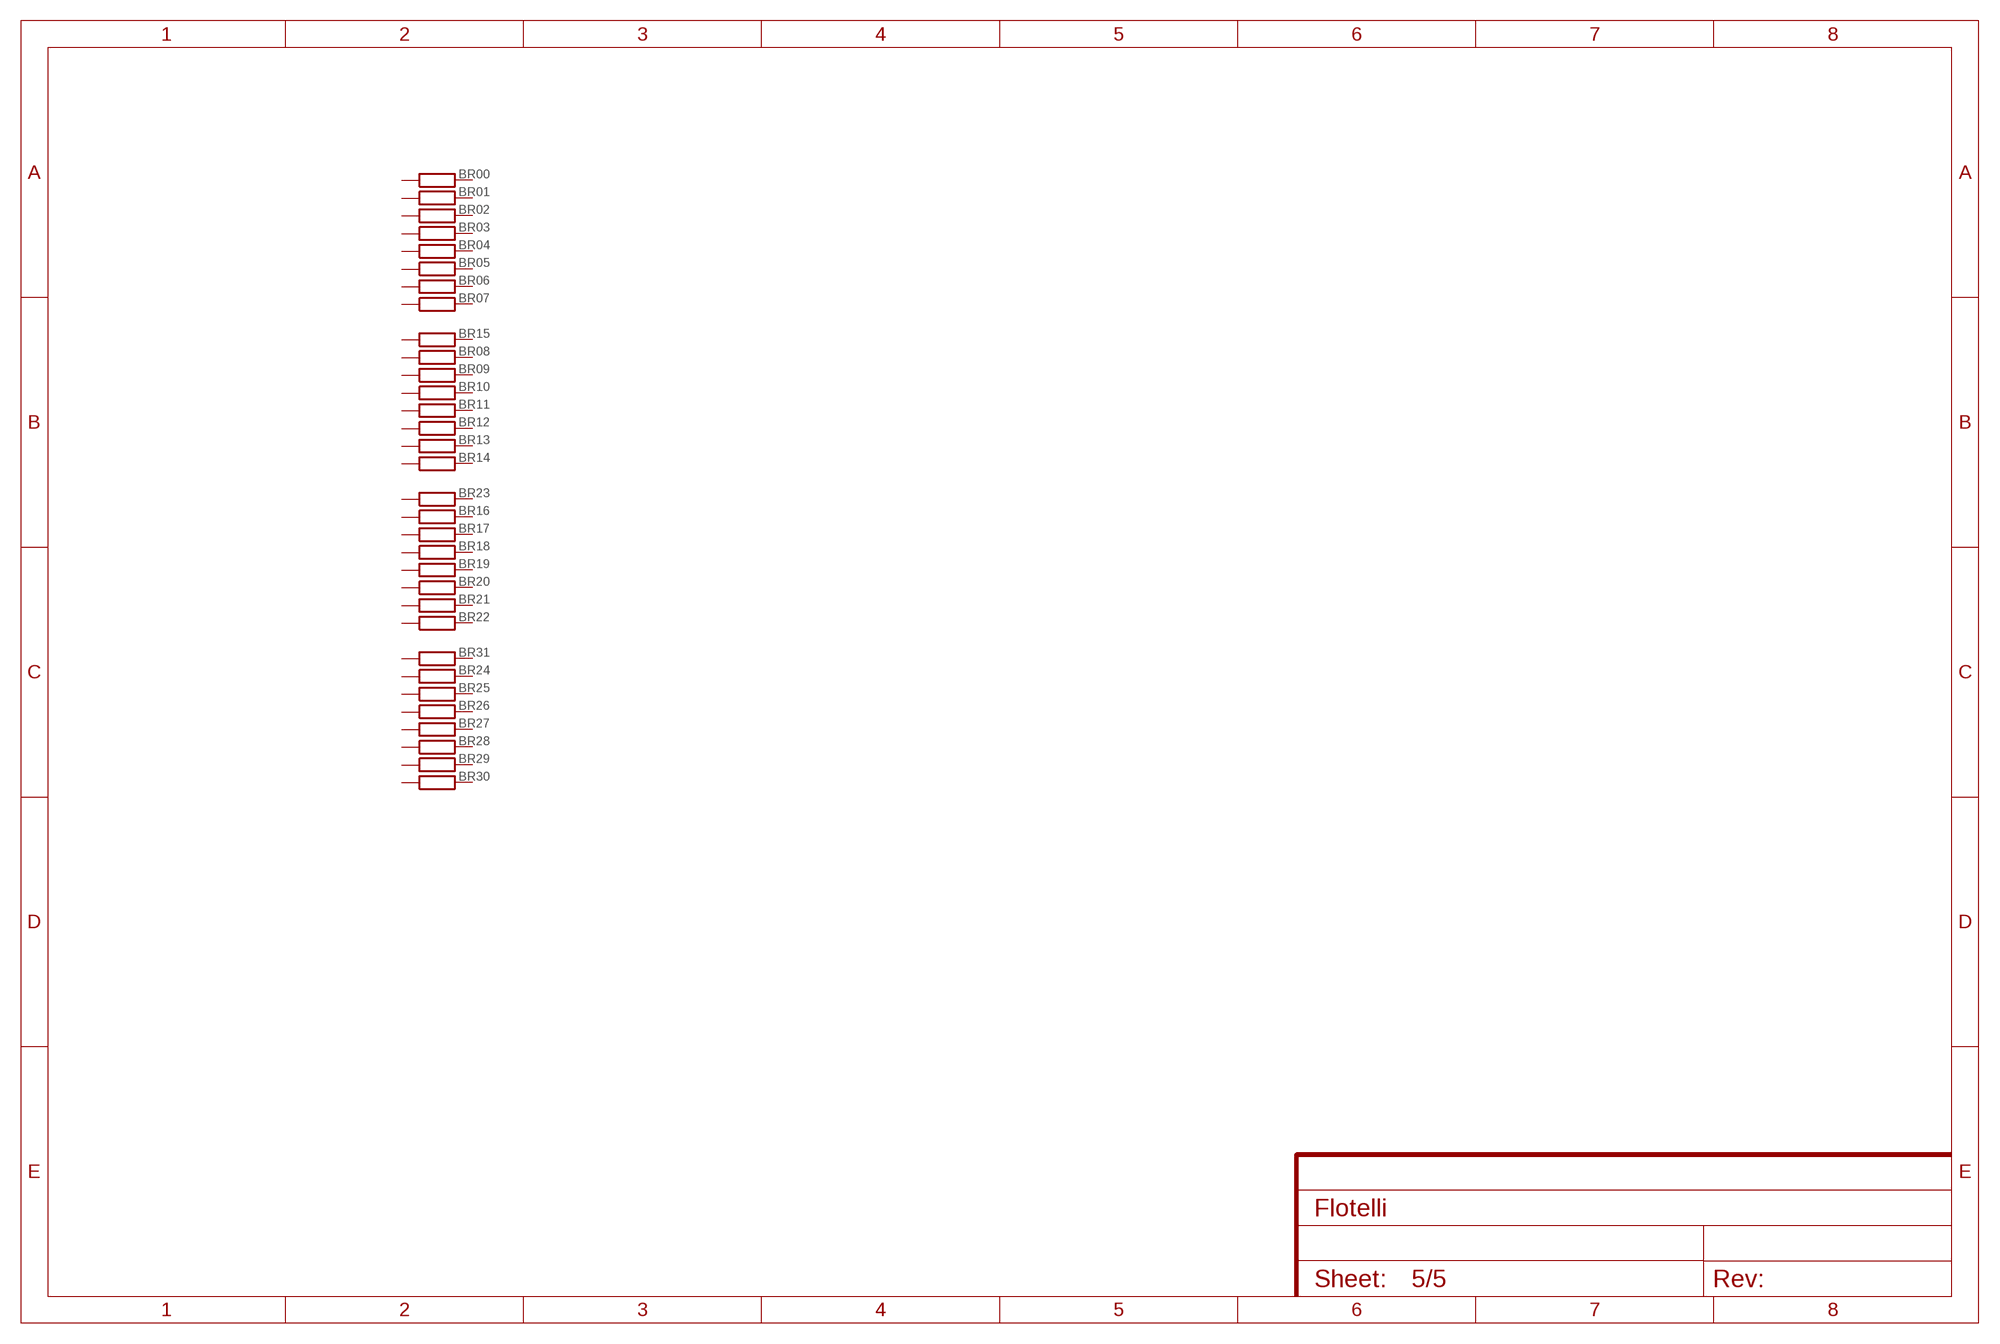
[diagram p4: schematic, sheet 5]

### Parts
BR00  100  R0603  [R0603]
BR01  100  R0603  [R0603]
BR02  100  R0603  [R0603]
BR03  100  R0603  [R0603]
BR04  100  R0603  [R0603]
BR05  100  R0603  [R0603]
BR06  100  R0603  [R0603]
BR07  100  R0603  [R0603]
BR08  100  R0603  [R0603]
BR09  100  R0603  [R0603]
BR10  100  R0603  [R0603]
BR11  100  R0603  [R0603]
BR12  100  R0603  [R0603]
BR13  100  R0603  [R0603]
BR14  100  R0603  [R0603]
BR15  100  R0603  [R0603]
BR16  100  R0603  [R0603]
BR17  100  R0603  [R0603]
BR18  100  R0603  [R0603]
BR19  100  R0603  [R0603]
BR20  100  R0603  [R0603]
BR21  100  R0603  [R0603]
BR22  100  R0603  [R0603]
BR23  100  R0603  [R0603]
BR24  100  R0603  [R0603]
BR25  100  R0603  [R0603]
BR26  100  R0603  [R0603]
BR27  100  R0603  [R0603]
BR28  100  R0603  [R0603]
BR29  100  R0603  [R0603]
BR30  100  R0603  [R0603]
BR31  100  R0603  [R0603]
Unconnected: BR00.1 BR00.2 BR01.1 BR01.2 BR02.1 BR02.2 BR03.1 BR03.2 BR04.1 BR04.2 BR05.1 BR05.2 BR06.1 BR06.2 BR07.1 BR07.2 BR08.1 BR08.2 BR09.1 BR09.2 BR10.1 BR10.2 BR11.1 BR11.2 BR12.1 BR12.2 BR13.1 BR13.2 BR14.1 BR14.2 BR15.1 BR15.2 BR16.1 BR16.2 BR17.1 BR17.2 BR18.1 BR18.2 BR19.1 BR19.2 BR20.1 BR20.2 BR21.1 BR21.2 BR22.1 BR22.2 BR23.1 BR23.2 BR24.1 BR24.2 BR25.1 BR25.2 BR26.1 BR26.2 BR27.1 BR27.2 BR28.1 BR28.2 BR29.1 BR29.2 BR30.1 BR30.2 BR31.1 BR31.2

## Power pins joined to a net without a drawn wire
3.3V: J2.6(3.3V) J4.6(3.3V)
5V: J2.8(5V) J4.8(5V)
GND: J2.12(GND) J2.14(GND) J4.12(GND) J4.14(GND)
VBATT: J2.4(VBATT) J4.4(VBATT)
VCC(IO): J2.2(VCC(IO)) J4.2(VCC(IO))
VIN: J2.10(VIN) J4.10(VIN)

## Library data of the parts
BR00 BR01-BR09 BR10-BR31 R1 R2 R33 Y1-R1 = ELL-i-Passives:R: Surface Mount Resistor — in standard sizes
C1-C18 Y1-C1 Y1-C2 = ELL-i-Passives:C: Surface Mount Capasitors — in standard sizes A capacitor used to store energy electrostatically in an electric field. If you need a high-value capacitor, consider using a polarised capacitor to save space. Wikipedia article on capacitors <https://en.wikipedia.org/wiki/Capacitor>
CSSPIN PC14 PC15 = testpad:TPS: TEST PIN
D2 = SparkFun-LED:LED-GREEN: Various green LEDs 0603- DIO-00821 LARGE- DIO-00862 LILYPAD- DIO-09910; PROD_ID: DIO-00821; VALUE: GREEN
D3 = ell-i:BAT60J
FB1 FB2 = ell-i:LQM15
FID1-FID4 = microbuilder:FIDUCIAL: Fiducial Alignment Points Various fiducial points for machine vision alignment.
J1 = ELL-i-Connectors:FTDI-SER-6: FTDI cable connector In several package variant, including pogopin version.
J2 J4 = ELL-i-Connectors:DF12-ELLI-*
J3 = ELL-i-Connectors:DF12-32DP-0.5V: Hirose DF12 32-pin female (header) 0.5 mm pitch SMT board-to-board connector Datasheet <https://www.sparkfun.com/datasheets/Cellular%20Modules/ADH8066connector.pdf> (from SparkFun) This connector is used in the TinyDuino boards <http://tiny-circuits.com/products/tinyduino/>.
SV2-SV5 = SparkFun-Connectors:M09: Header 9 Standard 9-pin 0.1" header. Use with straight break away headers (SKU : PRT-00116), right angle break away headers (PRT-00553), swiss pins (PRT-00743), machine pins (PRT-00117), and female headers (PRT-00115).
U1 = ELL-i-DigitalIC:STM32F429Z: STM32F427 / 429 in LQFP144 or WLCSP143 package. STM32F4-series Cortex-M4 microcontroller in a 144 or 143 lead package. Datasheet (DM00071990.pdf) <http://www.st.com/web/en/resource/technical/document/datasheet/DM00071990.pdf> .; FLASH: 2048
U2 = ELL-i-DigitalIC:LCMXO2-2000: MachXO2-2000 in csBGA132 or TQFP144 package. Lattice MachXO2-series FPGA in a 132 ball chip size BGA or 144 lead TQFP package. Datasheet <http://www.latticesemi.com/~/media/Documents/DataSheets/MachXO23/MachXO2FamilyDataSheet.pdf> (DS1035) .
U4 = ELL-i-DigitalIC:LAN8720: Small Footprint RMII 10/100 Ethernet Transceiver Datasheet <http://media.digikey.com/pdf/Data%20Sheets/SMSC/LAN8720.pdf> Mouser: 886-LAN8720AI-CP
VIA1-VIA18 = ell-i:VIA
X1-X4 = ELL-i-Connectors:M-BOLT: Metric bolt connector
Y1 = crystal:CRYSTAL: CRYSTAL; OC_FARNELL: unknown; OC_NEWARK: unknown

## Net classes
0 default: width 0.1 mm, drill 0.3 mm, clearance 0.1 mm
1 power: width 0.3 mm, drill 0.3 mm, clearance 0.15 mm
2 high_voltage: width 0.15 mm, drill 0.3 mm, clearance 0.5 mm
3 high_power: width 0.5 mm, drill 0.3 mm, clearance 0.15 mm

## Board
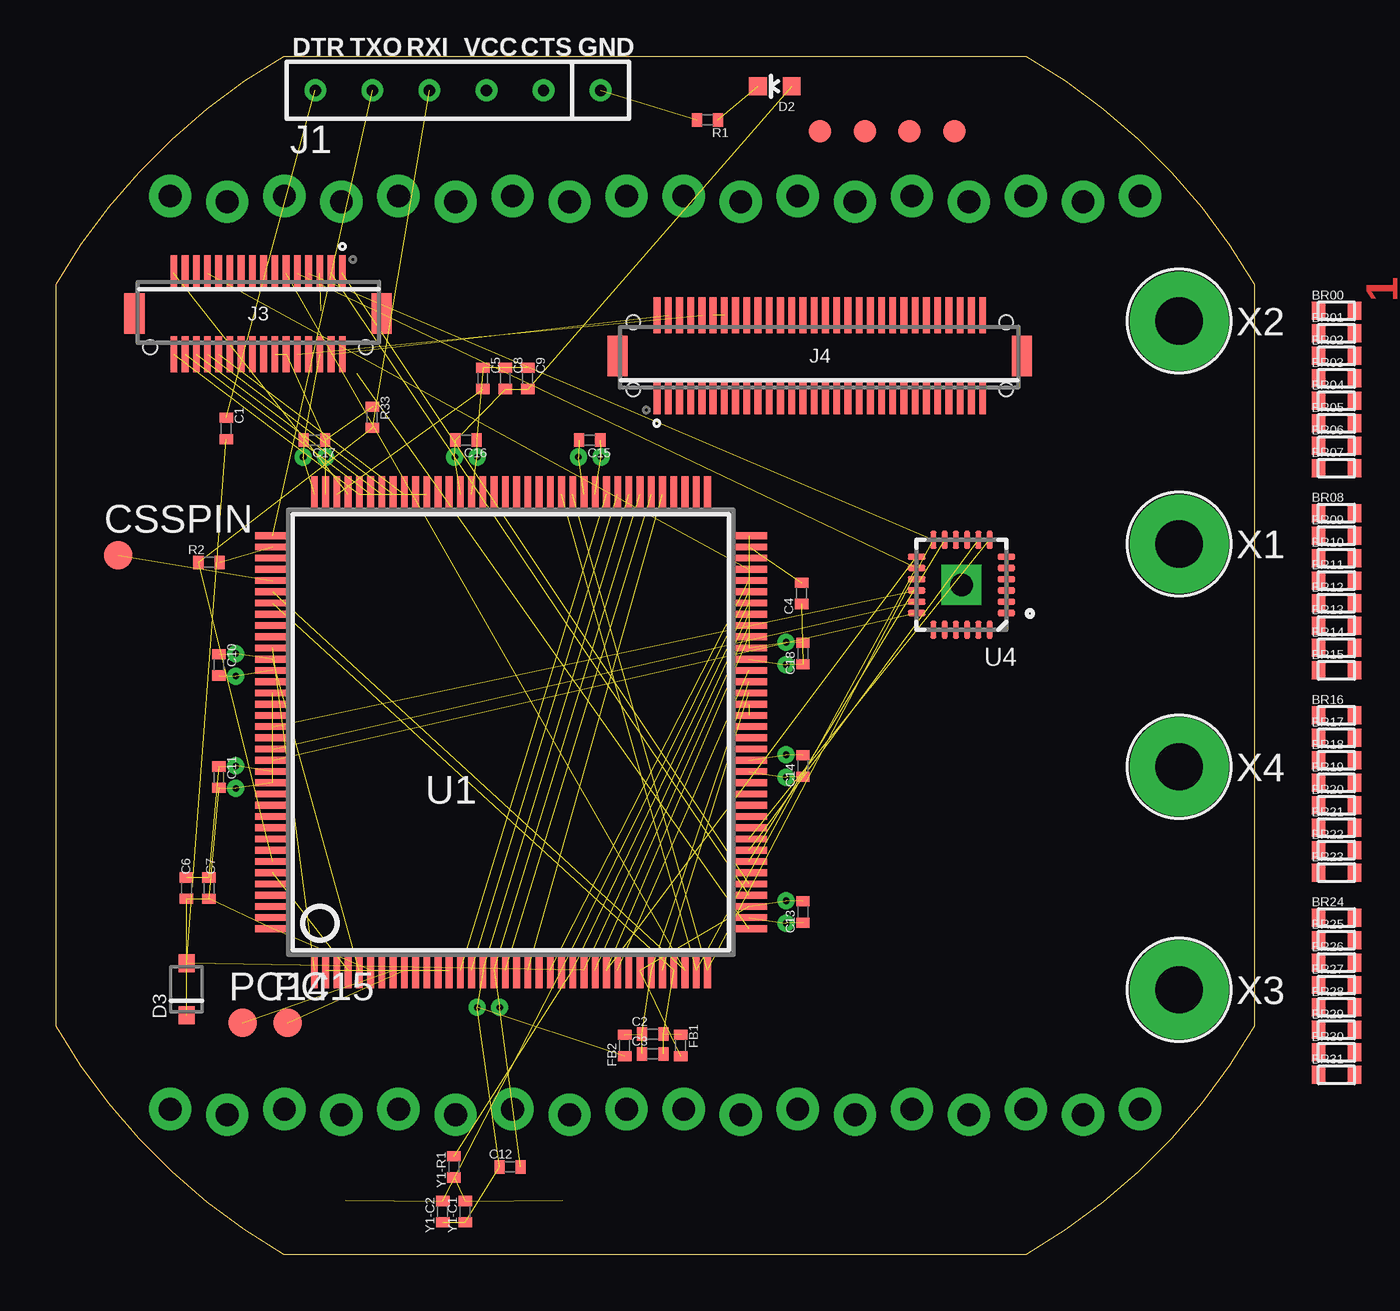
[diagram p5: board, top side]
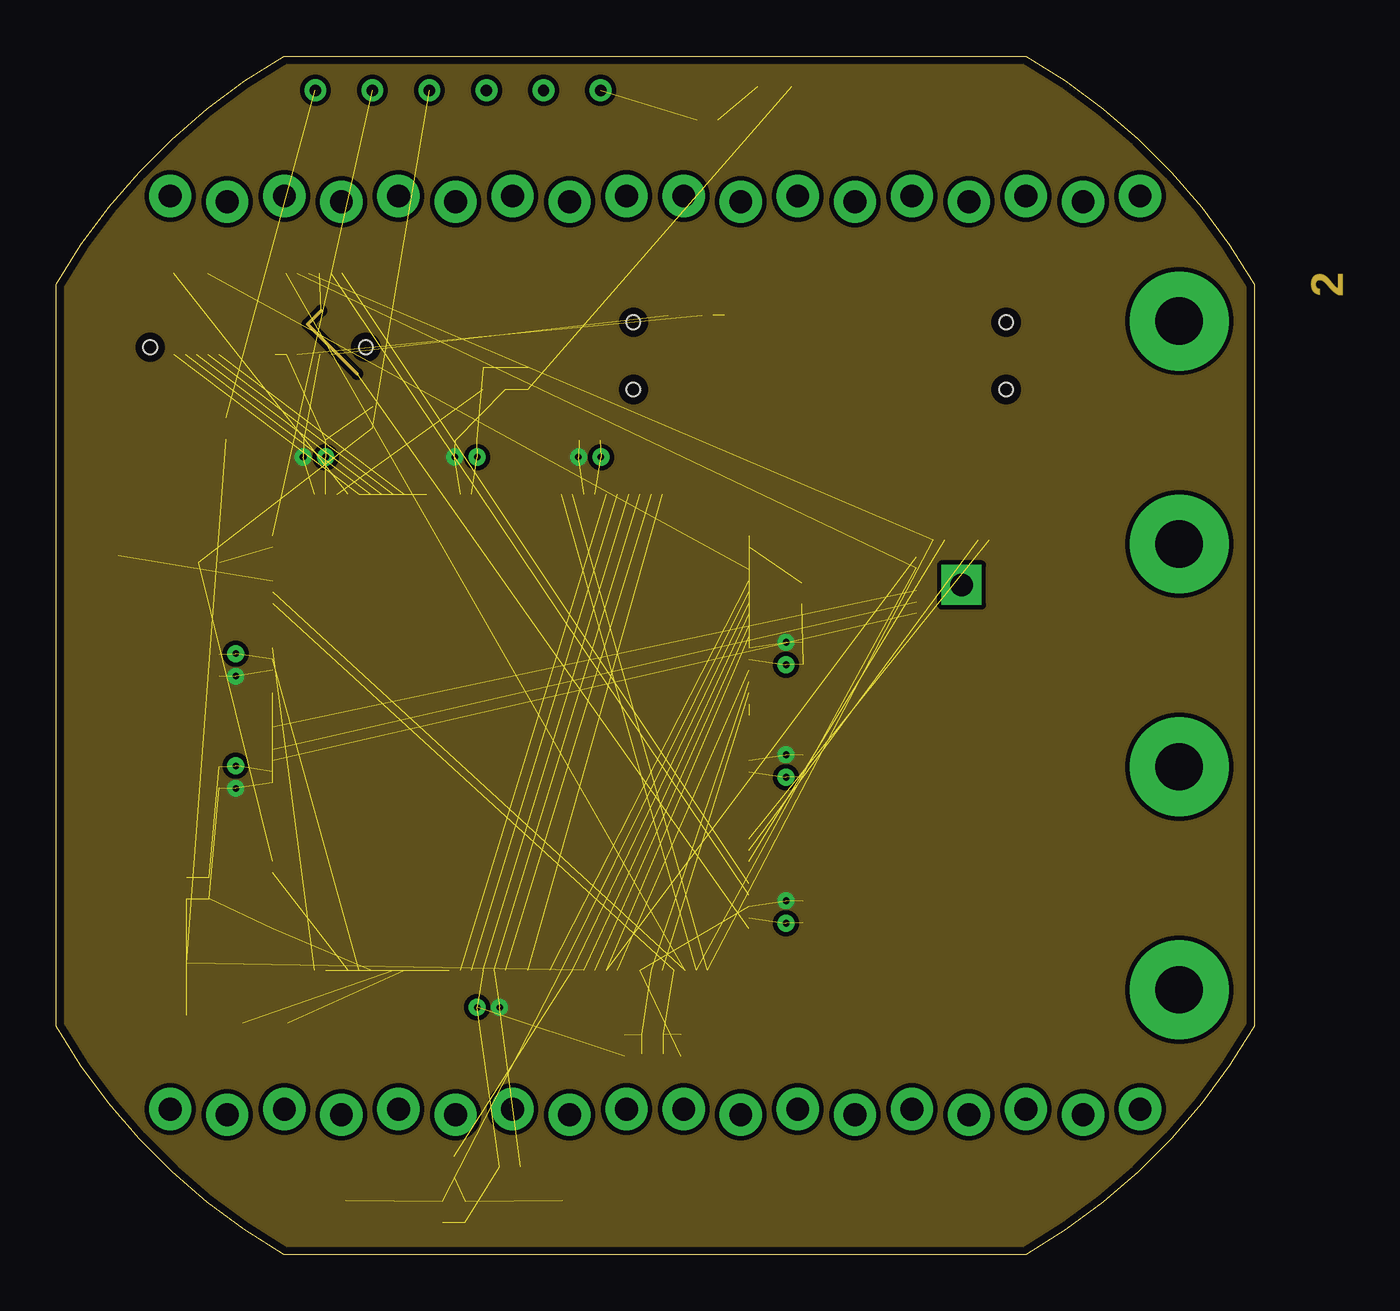
[diagram p6: board, inner layer Layer2]
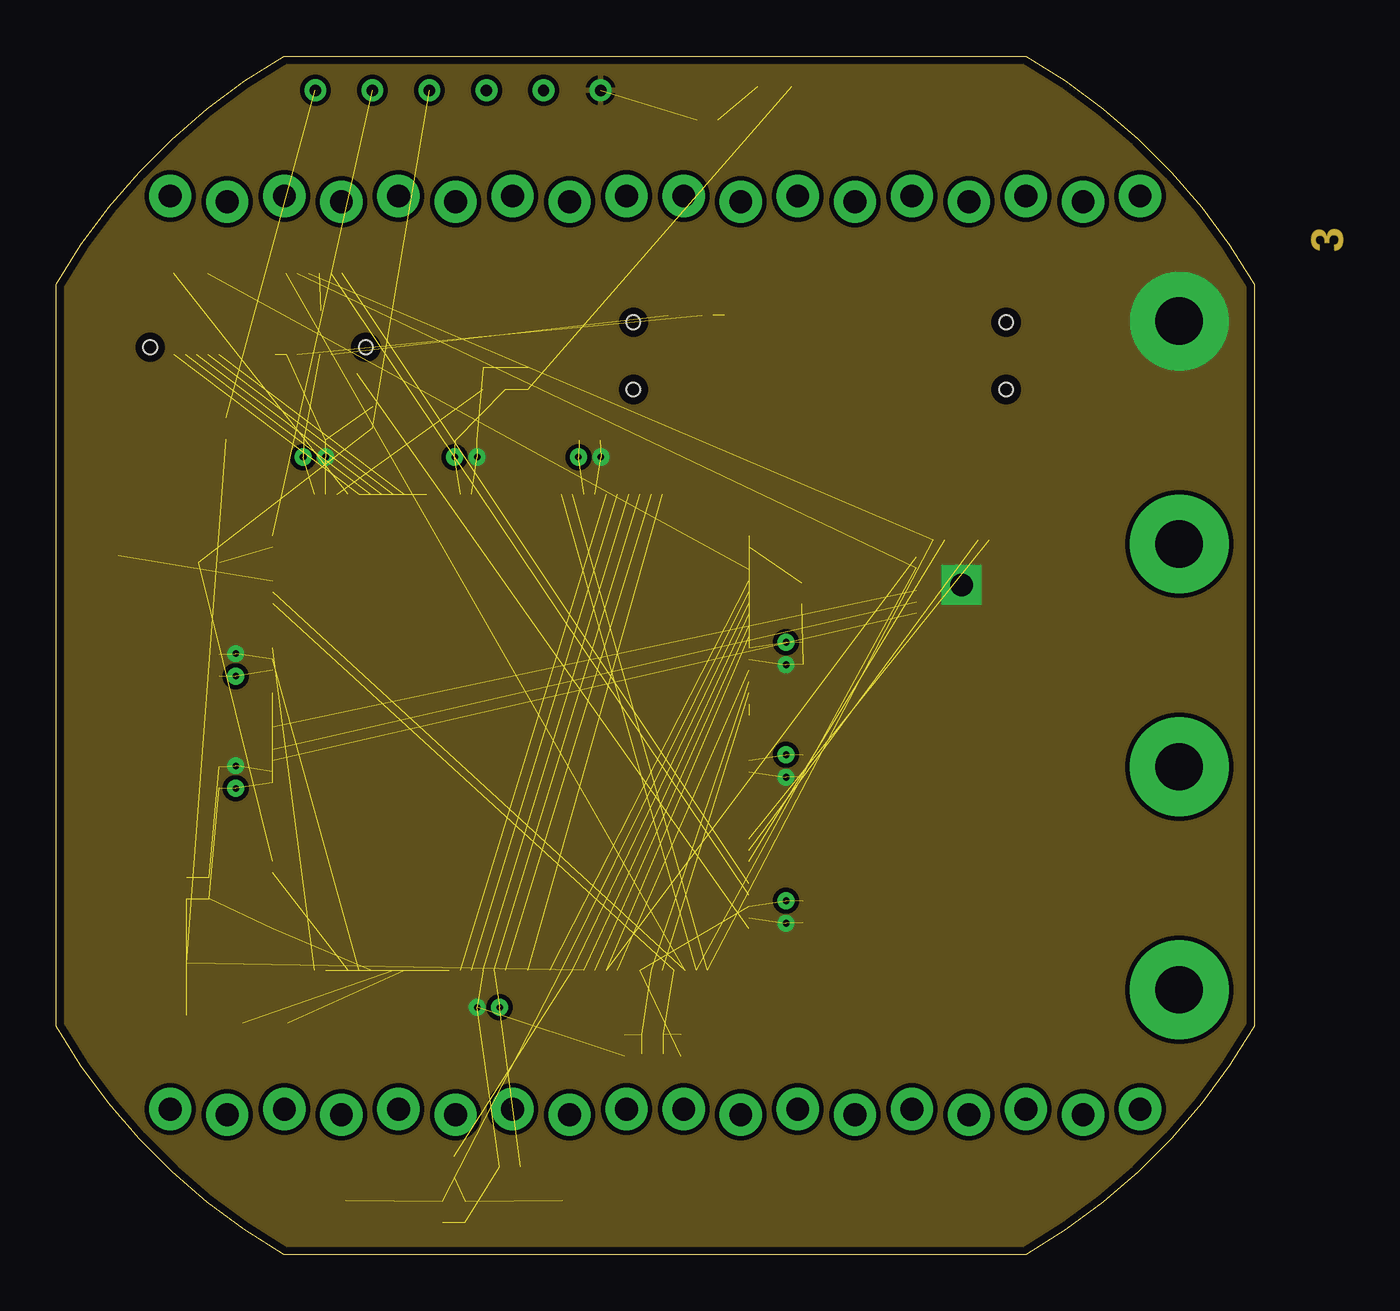
[diagram p7: board, inner layer Layer3]
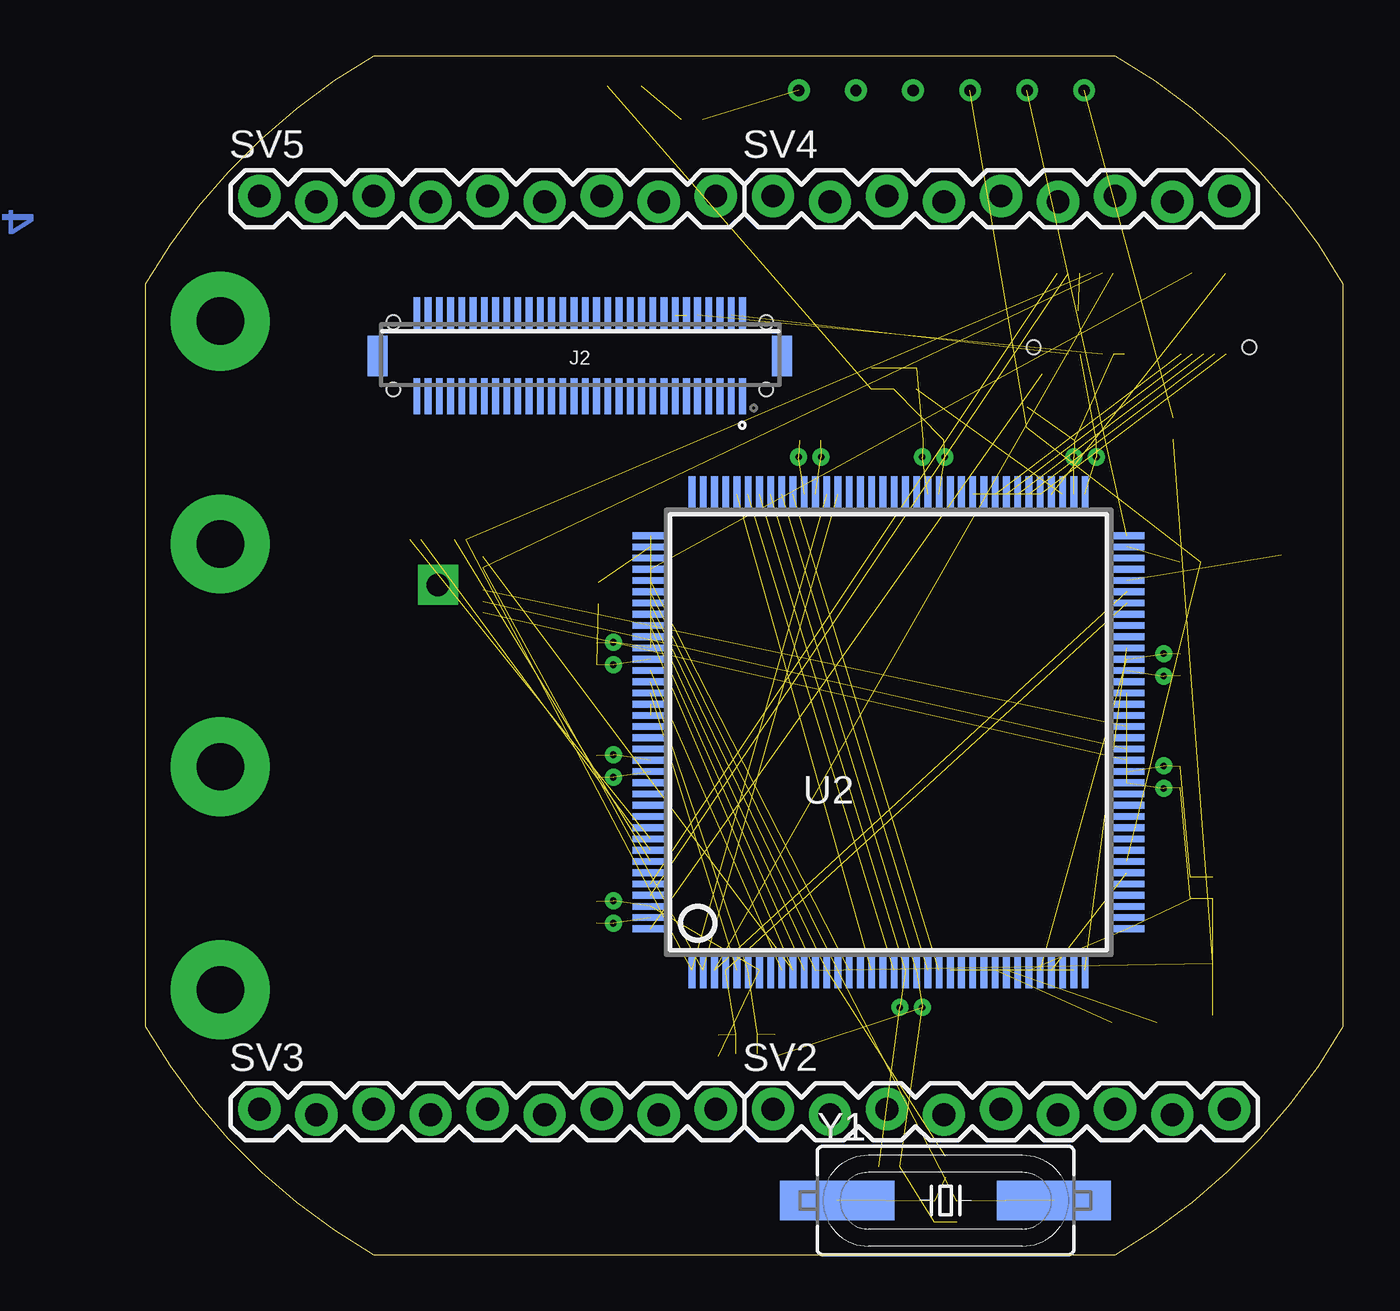
[diagram p8: board, bottom side, seen from below]

Size 53.34 x 53.34 mm. Coordinates in mm from the lower left corner, seen from the top.
Outline: 53.34,10.16 arc-30 43.18,0 10.16,0 arc-30 0,10.16 0,43.18 arc-30 10.16,53.34 43.18,53.34 arc-30 53.34,43.18 53.34,10.16
Copper layers (1*2*15*16): Top 0.035mm / dielectric 0.2mm / Layer2 0.035mm / dielectric 1mm / Layer3 0.035mm / dielectric 0.2mm / Bottom 0.035mm
Design rules "Ell-duino *": minimum track width 0.15mm, minimum drill 0.3mm, track to track 0.2mm, track to pad 0.2mm, pad to pad 0.2mm, via to via 0.2mm, smd to smd 0mil, copper to edge 0.35mm, drill to drill 0.4mm, minimum pad ring 9mil, minimum via ring 0.125mm, stop-mask expansion 2mil, vias tented up to drill 1.29mm, thermal gap 0.18mm

### Footprints (pad centres in the part's own frame; a part is rotated, then mirrored left to right if it is on the bottom)
R0603 = smd 0.6 x 0.8: 1 -0.8,0; 2 0.8,0
C0402 = smd 0.45 x 0.6: 1 -0.475,0; 2 0.475,0
B1,27 = smd 1.27 x 1.27: TP 0,0
LED-0603 = smd 0.8 x 0.8: A 0,-0.75; C 0,0.75
SOD323_DIODE = smd 0.8 x 0.7: 1 -1.15,0; 2 1.15,0
0402 = smd 0.45 x 0.6: 1 -0.475,0; 2 0.475,0
FIDUCIAL_1MM = smd 1 x 1: 1 0,0
FTDI-SER-6-SIL = drill 0.508: -CTS 3.81,0; -RTS -6.35,0; GND 6.35,0; RXD -3.81,0; TXD -1.27,0; VCC 1.27,0
DF12-60DS-0.5V = smd 0.3 x 1.6: 1 -7.25,1.8; 2 -7.25,-1.8; 3 -6.75,1.8; 4 -6.75,-1.8; 5 -6.25,1.8; 6 -6.25,-1.8; 7 -5.75,1.8; 8 -5.75,-1.8; 9 -5.25,1.8; 10 -5.25,-1.8; 11 -4.75,1.8; 12 -4.75,-1.8; 13 -4.25,1.8; 14 -4.25,-1.8; 15 -3.75,1.8; 16 -3.75,-1.8; 17 -3.25,1.8; 18 -3.25,-1.8; 19 -2.75,1.8; 20 -2.75,-1.8; 21 -2.25,1.8; 22 -2.25,-1.8; 23 -1.75,1.8; 24 -1.75,-1.8; 25 -1.25,1.8; 26 -1.25,-1.8; 27 -0.75,1.8; 28 -0.75,-1.8; 29 -0.25,1.8; 30 -0.25,-1.8; 31 0.25,1.8; 32 0.25,-1.8; 33 0.75,1.8; 34 0.75,-1.8; 35 1.25,1.8; 36 1.25,-1.8; 37 1.75,1.8; 38 1.75,-1.8; 39 2.25,1.8; 40 2.25,-1.8; 41 2.75,1.8; 42 2.75,-1.8; 43 3.25,1.8; 44 3.25,-1.8; 45 3.75,1.8; 46 3.75,-1.8; 47 4.25,1.8; 48 4.25,-1.8; 49 4.75,1.8; 50 4.75,-1.8; 51 5.25,1.8; 52 5.25,-1.8; 53 5.75,1.8; 54 5.75,-1.8; 55 6.25,1.8; 56 6.25,-1.8; 57 6.75,1.8; 58 6.75,-1.8; 59 7.25,1.8; 60 7.25,-1.8 | smd 0.9 x 1.8: F1 -9,0; F2 9,0 | hole 0.6: -8.3,1.5; 8.3,1.5
DF12(4.0)-32DP-0.5V = smd 0.3 x 1.6: 1 -3.75,-1.8; 2 -3.75,1.8; 3 -3.25,-1.8; 4 -3.25,1.8; 5 -2.75,-1.8; 6 -2.75,1.8; 7 -2.25,-1.8; 8 -2.25,1.8; 9 -1.75,-1.8; 10 -1.75,1.8; 11 -1.25,-1.8; 12 -1.25,1.8; 13 -0.75,-1.8; 14 -0.75,1.8; 15 -0.25,-1.8; 16 -0.25,1.8; 17 0.25,-1.8; 18 0.25,1.8; 19 0.75,-1.8; 20 0.75,1.8; 21 1.25,-1.8; 22 1.25,1.8; 23 1.75,-1.8; 24 1.75,1.8; 25 2.25,-1.8; 26 2.25,1.8; 27 2.75,-1.8; 28 2.75,1.8; 29 3.25,-1.8; 30 3.25,1.8; 31 3.75,-1.8; 32 3.75,1.8 | smd 0.9 x 1.8: F1 -5.5,0; F2 5.5,0 | hole 0.6: -4.8,1.5; 4.8,1.5
DF12(4.0)-60DP-0.5V = smd 0.3 x 1.6: 1 -7.25,-1.8; 2 -7.25,1.8; 3 -6.75,-1.8; 4 -6.75,1.8; 5 -6.25,-1.8; 6 -6.25,1.8; 7 -5.75,-1.8; 8 -5.75,1.8; 9 -5.25,-1.8; 10 -5.25,1.8; 11 -4.75,-1.8; 12 -4.75,1.8; 13 -4.25,-1.8; 14 -4.25,1.8; 15 -3.75,-1.8; 16 -3.75,1.8; 17 -3.25,-1.8; 18 -3.25,1.8; 19 -2.75,-1.8; 20 -2.75,1.8; 21 -2.25,-1.8; 22 -2.25,1.8; 23 -1.75,-1.8; 24 -1.75,1.8; 25 -1.25,-1.8; 26 -1.25,1.8; 27 -0.75,-1.8; 28 -0.75,1.8; 29 -0.25,-1.8; 30 -0.25,1.8; 31 0.25,-1.8; 32 0.25,1.8; 33 0.75,-1.8; 34 0.75,1.8; 35 1.25,-1.8; 36 1.25,1.8; 37 1.75,-1.8; 38 1.75,1.8; 39 2.25,-1.8; 40 2.25,1.8; 41 2.75,-1.8; 42 2.75,1.8; 43 3.25,-1.8; 44 3.25,1.8; 45 3.75,-1.8; 46 3.75,1.8; 47 4.25,-1.8; 48 4.25,1.8; 49 4.75,-1.8; 50 4.75,1.8; 51 5.25,-1.8; 52 5.25,1.8; 53 5.75,-1.8; 54 5.75,1.8; 55 6.25,-1.8; 56 6.25,1.8; 57 6.75,-1.8; 58 6.75,1.8; 59 7.25,-1.8; 60 7.25,1.8 | smd 0.9 x 1.8: F1 -9,0; F2 9,0 | hole 0.6: -8.3,1.5; 8.3,1.5
R0402 = smd 0.45 x 0.6: 1 -0.475,0; 2 0.475,0
1X09_LOCK = drill 1.016 pad 1.88: 1 0,0.127; 2 2.54,-0.127; 3 5.08,0.127; 4 7.62,-0.127; 5 10.16,0.127; 6 12.7,-0.127; 7 15.24,0.127; 8 17.78,-0.127; 9 20.32,0.127
LQFP144 = smd 0.3 x 1.6: 1 -8.75,-10.6; 2 -8.25,-10.6; 3 -7.75,-10.6; 4 -7.25,-10.6; 5 -6.75,-10.6; 6 -6.25,-10.6; 7 -5.75,-10.6; 8 -5.25,-10.6; 9 -4.75,-10.6; 10 -4.25,-10.6; 11 -3.75,-10.6; 12 -3.25,-10.6; 13 -2.75,-10.6; 14 -2.25,-10.6; 15 -1.75,-10.6; 16 -1.25,-10.6; 17 -0.75,-10.6; 18 -0.25,-10.6; 19 0.25,-10.6; 20 0.75,-10.6; 21 1.25,-10.6; 22 1.75,-10.6; 23 2.25,-10.6; 24 2.75,-10.6; 25 3.25,-10.6; 26 3.75,-10.6; 27 4.25,-10.6; 28 4.75,-10.6; 29 5.25,-10.6; 30 5.75,-10.6; 31 6.25,-10.6; 32 6.75,-10.6; 33 7.25,-10.6; 34 7.75,-10.6; 35 8.25,-10.6; 36 8.75,-10.6; 73 8.75,10.6; 74 8.25,10.6; 75 7.75,10.6; 76 7.25,10.6; 77 6.75,10.6; 78 6.25,10.6; 79 5.75,10.6; 80 5.25,10.6; 81 4.75,10.6; 82 4.25,10.6; 83 3.75,10.6; 84 3.25,10.6; 85 2.75,10.6; 86 2.25,10.6; 87 1.75,10.6; 88 1.25,10.6; 89 0.75,10.6; 90 0.25,10.6; 91 -0.25,10.6; 92 -0.75,10.6; 93 -1.25,10.6; 94 -1.75,10.6; 95 -2.25,10.6; 96 -2.75,10.6; 97 -3.25,10.6; 98 -3.75,10.6; 99 -4.25,10.6; 100 -4.75,10.6; 101 -5.25,10.6; 102 -5.75,10.6; 103 -6.25,10.6; 104 -6.75,10.6; 105 -7.25,10.6; 106 -7.75,10.6; 107 -8.25,10.6; 108 -8.75,10.6 | smd 1.6 x 0.3: 37 10.6,-8.75; 38 10.6,-8.25; 39 10.6,-7.75; 40 10.6,-7.25; 41 10.6,-6.75; 42 10.6,-6.25; 43 10.6,-5.75; 44 10.6,-5.25; 45 10.6,-4.75; 46 10.6,-4.25; 47 10.6,-3.75; 48 10.6,-3.25; 49 10.6,-2.75; 50 10.6,-2.25; 51 10.6,-1.75; 52 10.6,-1.25; 53 10.6,-0.75; 54 10.6,-0.25; 55 10.6,0.25; 56 10.6,0.75; 57 10.6,1.25; 58 10.6,1.75; 59 10.6,2.25; 60 10.6,2.75; 61 10.6,3.25; 62 10.6,3.75; 63 10.6,4.25; 64 10.6,4.75; 65 10.6,5.25; 66 10.6,5.75; 67 10.6,6.25; 68 10.6,6.75; 69 10.6,7.25; 70 10.6,7.75; 71 10.6,8.25; 72 10.6,8.75; 109 -10.6,8.75; 110 -10.6,8.25; 111 -10.6,7.75; 112 -10.6,7.25; 113 -10.6,6.75; 114 -10.6,6.25; 115 -10.6,5.75; 116 -10.6,5.25; 117 -10.6,4.75; 118 -10.6,4.25; 119 -10.6,3.75; 120 -10.6,3.25; 121 -10.6,2.75; 122 -10.6,2.25; 123 -10.6,1.75; 124 -10.6,1.25; 125 -10.6,0.75; 126 -10.6,0.25; 127 -10.6,-0.25; 128 -10.6,-0.75; 129 -10.6,-1.25; 130 -10.6,-1.75; 131 -10.6,-2.25; 132 -10.6,-2.75; 133 -10.6,-3.25; 134 -10.6,-3.75; 135 -10.6,-4.25; 136 -10.6,-4.75; 137 -10.6,-5.25; 138 -10.6,-5.75; 139 -10.6,-6.25; 140 -10.6,-6.75; 141 -10.6,-7.25; 142 -10.6,-7.75; 143 -10.6,-8.25; 144 -10.6,-8.75 | smd 0 x 0: NC 0,0
TQFP144 = smd 0.3 x 1.6: 1 -8.75,-10.6; 2 -8.25,-10.6; 3 -7.75,-10.6; 4 -7.25,-10.6; 5 -6.75,-10.6; 6 -6.25,-10.6; 7 -5.75,-10.6; 8 -5.25,-10.6; 9 -4.75,-10.6; 10 -4.25,-10.6; 11 -3.75,-10.6; 12 -3.25,-10.6; 13 -2.75,-10.6; 14 -2.25,-10.6; 15 -1.75,-10.6; 16 -1.25,-10.6; 17 -0.75,-10.6; 18 -0.25,-10.6; 19 0.25,-10.6; 20 0.75,-10.6; 21 1.25,-10.6; 22 1.75,-10.6; 23 2.25,-10.6; 24 2.75,-10.6; 25 3.25,-10.6; 26 3.75,-10.6; 27 4.25,-10.6; 28 4.75,-10.6; 29 5.25,-10.6; 30 5.75,-10.6; 31 6.25,-10.6; 32 6.75,-10.6; 33 7.25,-10.6; 34 7.75,-10.6; 35 8.25,-10.6; 36 8.75,-10.6; 73 8.75,10.6; 74 8.25,10.6; 75 7.75,10.6; 76 7.25,10.6; 77 6.75,10.6; 78 6.25,10.6; 79 5.75,10.6; 80 5.25,10.6; 81 4.75,10.6; 82 4.25,10.6; 83 3.75,10.6; 84 3.25,10.6; 85 2.75,10.6; 86 2.25,10.6; 87 1.75,10.6; 88 1.25,10.6; 89 0.75,10.6; 90 0.25,10.6; 91 -0.25,10.6; 92 -0.75,10.6; 93 -1.25,10.6; 94 -1.75,10.6; 95 -2.25,10.6; 96 -2.75,10.6; 97 -3.25,10.6; 98 -3.75,10.6; 99 -4.25,10.6; 100 -4.75,10.6; 101 -5.25,10.6; 102 -5.75,10.6; 103 -6.25,10.6; 104 -6.75,10.6; 105 -7.25,10.6; 106 -7.75,10.6; 107 -8.25,10.6; 108 -8.75,10.6 | smd 1.6 x 0.3: 37 10.6,-8.75; 38 10.6,-8.25; 39 10.6,-7.75; 40 10.6,-7.25; 41 10.6,-6.75; 42 10.6,-6.25; 43 10.6,-5.75; 44 10.6,-5.25; 45 10.6,-4.75; 46 10.6,-4.25; 47 10.6,-3.75; 48 10.6,-3.25; 49 10.6,-2.75; 50 10.6,-2.25; 51 10.6,-1.75; 52 10.6,-1.25; 53 10.6,-0.75; 54 10.6,-0.25; 55 10.6,0.25; 56 10.6,0.75; 57 10.6,1.25; 58 10.6,1.75; 59 10.6,2.25; 60 10.6,2.75; 61 10.6,3.25; 62 10.6,3.75; 63 10.6,4.25; 64 10.6,4.75; 65 10.6,5.25; 66 10.6,5.75; 67 10.6,6.25; 68 10.6,6.75; 69 10.6,7.25; 70 10.6,7.75; 71 10.6,8.25; 72 10.6,8.75; 109 -10.6,8.75; 110 -10.6,8.25; 111 -10.6,7.75; 112 -10.6,7.25; 113 -10.6,6.75; 114 -10.6,6.25; 115 -10.6,5.75; 116 -10.6,5.25; 117 -10.6,4.75; 118 -10.6,4.25; 119 -10.6,3.75; 120 -10.6,3.25; 121 -10.6,2.75; 122 -10.6,2.25; 123 -10.6,1.75; 124 -10.6,1.25; 125 -10.6,0.75; 126 -10.6,0.25; 127 -10.6,-0.25; 128 -10.6,-0.75; 129 -10.6,-1.25; 130 -10.6,-1.75; 131 -10.6,-2.25; 132 -10.6,-2.75; 133 -10.6,-3.25; 134 -10.6,-3.75; 135 -10.6,-4.25; 136 -10.6,-4.75; 137 -10.6,-5.25; 138 -10.6,-5.75; 139 -10.6,-6.25; 140 -10.6,-6.75; 141 -10.6,-7.25; 142 -10.6,-7.75; 143 -10.6,-8.25; 144 -10.6,-8.75
QFN-24_4MM-H = smd 0.8 x 0.28: 1 -2,1.25; 2 -2,0.75; 3 -2,0.25; 4 -2,-0.25; 5 -2,-0.75; 6 -2,-1.25; 13 2,-1.25; 14 2,-0.75; 15 2,-0.25; 16 2,0.25; 17 2,0.75; 18 2,1.25 | smd 0.28 x 0.8: 7 -1.25,-2; 8 -0.75,-2; 9 -0.25,-2; 10 0.25,-2; 11 0.75,-2; 12 1.25,-2; 19 1.25,2; 20 0.75,2; 21 0.25,2; 22 -0.25,2; 23 -0.75,2; 24 -1.25,2 | drill 1 pad 1.778 square: THERM 0,0
VIA-0.3MM = drill 0.3 pad 0.61: 1 0,0
M2-1 = drill 2.1 pad 4.4: 1 0,0
SM49 = smd 5.08 x 1.778: 1 -4.826,0; 2 4.826,0

### Placement (x,y rotation side)
BR00  57,42 0 top
BR01  57,41 0 top
BR02  57,40 0 top
BR03  57,39 0 top
BR04  57,38 0 top
BR05  57,37 0 top
BR06  57,36 0 top
BR07  57,35 0 top
BR08  57,33 0 top
BR09  57,32 0 top
BR10  57,31 0 top
BR11  57,30 0 top
BR12  57,29 0 top
BR13  57,28 0 top
BR14  57,27 0 top
BR15  57,26 0 top
BR16  57,24 0 top
BR17  57,23 0 top
BR18  57,22 0 top
BR19  57,21 0 top
BR20  57,20 0 top
BR21  57,19 0 top
BR22  57,18 0 top
BR23  57,17 0 top
BR24  57,15 0 top
BR25  57,14 0 top
BR26  57,13 0 top
BR27  57,12 0 top
BR28  57,11 0 top
BR29  57,10 0 top
BR30  57,9 0 top
BR31  57,8 0 top
C1  7.58,36.77 270 top
C2  26.56,9.81 0 top
C3  26.56,8.94 0 top
C4  33.19,29.43 90 top
C5  19,39 270 top
C6  5.81,16.31 270 top
C7  6.81,16.31 270 top
C8  20,39 270 top
C9  21,39 270 top
C10  7.25,26.25 270 top
C11  7.25,21.25 270 top
C12  20.21,3.91 0 top
C13  33.25,15.25 90 top
C14  33.25,21.75 90 top
C15  23.75,36.25 180 top
C16  18.25,36.25 180 top
C17  11.5,36.25 180 top
C18  33.25,26.75 90 top
CSSPIN  2.77,31.12 0 top
D2  32,52 90 top
D3  5.81,11.81 90 top
FB1  27.81,9.31 270 top
FB2  25.31,9.31 90 top
FID1  34,50 0 top
FID2  36,50 0 top
FID3  38,50 0 top
FID4  40,50 0 top
J1  17.89,51.82 0 top
J2  34,40 180 bottom
J3  8.99,41.88 180 top
J4  34,40 0 top
PC14  8.31,10.31 0 top
PC15  10.31,10.31 0 top
R1  29,50.5 180 top
R2  6.81,30.81 0 top
R33  14.08,37.27 270 top
SV2  25.4,6.35 0 bottom
SV3  48.26,6.35 0 bottom
SV4  25.4,46.99 0 bottom
SV5  48.26,46.99 0 bottom
U1  20.25,23.25 0 top
U2  20.25,23.25 0 bottom
U4  40.31,29.81 180 top
VIA1  8,20.75 90 top
VIA2  11,35.5 90 top
VIA3  23.25,35.5 90 top
VIA4  32.5,15.75 90 top
VIA5  32.5,22.25 90 top
VIA6  8,21.75 90 top
VIA7  12,35.5 90 top
VIA8  24.25,35.5 90 top
VIA9  32.5,14.75 90 top
VIA10  32.5,21.25 90 top
VIA11  17.75,35.5 90 top
VIA12  18.75,35.5 90 top
VIA13  19.75,11 90 top
VIA14  18.75,11 90 top
VIA15  32.5,27.25 0 top
VIA16  32.5,26.25 0 top
VIA17  8,25.75 0 top
VIA18  8,26.75 0 top
X1  50,31.63 0 top
X2  50,41.55 0 top
X3  50,11.79 0 top
X4  50,21.71 0 top
Y1  17.71,2.41 0 bottom
Y1-C1  18.21,1.91 90 top
Y1-C2  17.21,1.91 90 top
Y1-R1  17.71,3.91 90 top

### Tracks (layer width: path | path; a pad name or v marks a point on that pad's centre or on a via)
3.3V  (1 unrouted)
5V  (1 unrouted)
+3V3  (30 unrouted)
  pour Layer2: -5,55 55,55 55,-5 -5,-5
A0  (1 unrouted)
A2  (1 unrouted)
A3  (1 unrouted)
BOOT0  (3 unrouted)
CSSPIN  (1 unrouted)
D0  (1 unrouted)
D1  (1 unrouted)
D6  (2 unrouted)
  Layer2 0.15: 13.4,39.2 11.2,41.4 11.8,42
D10  (1 unrouted)
E13  (1 unrouted)
ETH_CLK  (2 unrouted)
ETH_CRS  (1 unrouted)
ETH_MDC  (1 unrouted)
ETH_MDIO  (2 unrouted)
ETH_RXD0  (1 unrouted)
ETH_RXD1  (1 unrouted)
ETH_TXD0  (1 unrouted)
ETH_TXD1  (1 unrouted)
ETH_TXEN  (1 unrouted)
GND  (3 unrouted)
GNDI  (31 unrouted)
  pour Layer3: -5,55 55,55 55,-5 -5,-5
JTCK  (1 unrouted)
JTDI  (2 unrouted)
JTMS  (1 unrouted)
MCO  (1 unrouted)
MEM_A10  (1 unrouted)
MEM_A16  (1 unrouted)
MEM_A17  (1 unrouted)
MEM_A18  (1 unrouted)
MEM_A19  (1 unrouted)
MEM_A21  (1 unrouted)
MEM_A22  (1 unrouted)
MEM_A23  (1 unrouted)
MEM_CS1  (1 unrouted)
MEM_D0  (1 unrouted)
MEM_D1  (1 unrouted)
MEM_D2  (1 unrouted)
MEM_D3  (1 unrouted)
MEM_D4  (1 unrouted)
MEM_D5  (1 unrouted)
MEM_D6  (1 unrouted)
MEM_D7  (1 unrouted)
MEM_D8  (1 unrouted)
MEM_D9  (1 unrouted)
MEM_D10  (1 unrouted)
MEM_D11  (1 unrouted)
MEM_D12  (1 unrouted)
MEM_D13  (1 unrouted)
MEM_D14  (1 unrouted)
MEM_D15  (1 unrouted)
N41567  (1 unrouted)
N98218  (3 unrouted)
N100630  (3 unrouted)
N205481  (2 unrouted)
N$2  (1 unrouted)
N$3  (1 unrouted)
N$4  (1 unrouted)
N$5  (1 unrouted)
NDSR2  (1 unrouted)
NRES  (2 unrouted)
PF0  (2 unrouted)
PF1  (1 unrouted)
PROGRAMN  (2 unrouted)
VBATT  (2 unrouted)
VCC(IO)  (1 unrouted)
VIN  (2 unrouted)

### Text on the board
Top: 1
Layer2: 2
Layer3: 3
Bottom: 4
bStop: www.ell-i.org | ELL-i proto 1.0